# Altium project C40 UPGRADES.PrjPCB
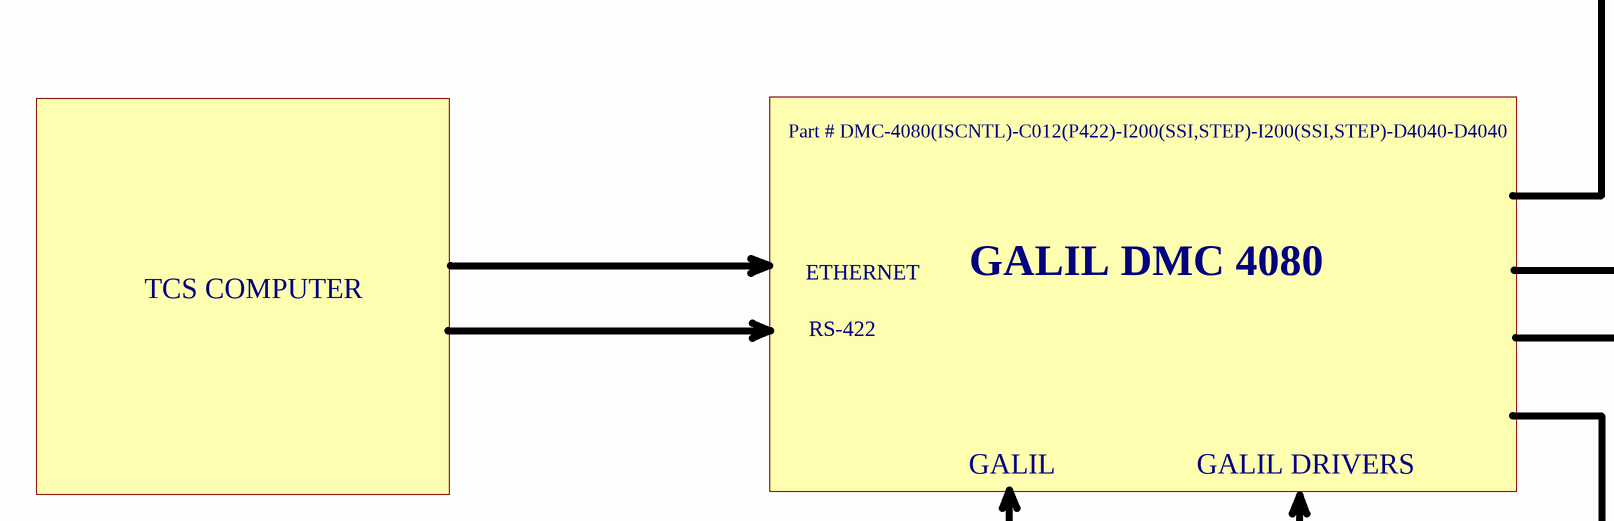
[diagram p0: C40_IMB_Upgrade_OVERVIEW.SCHDOC, top left]
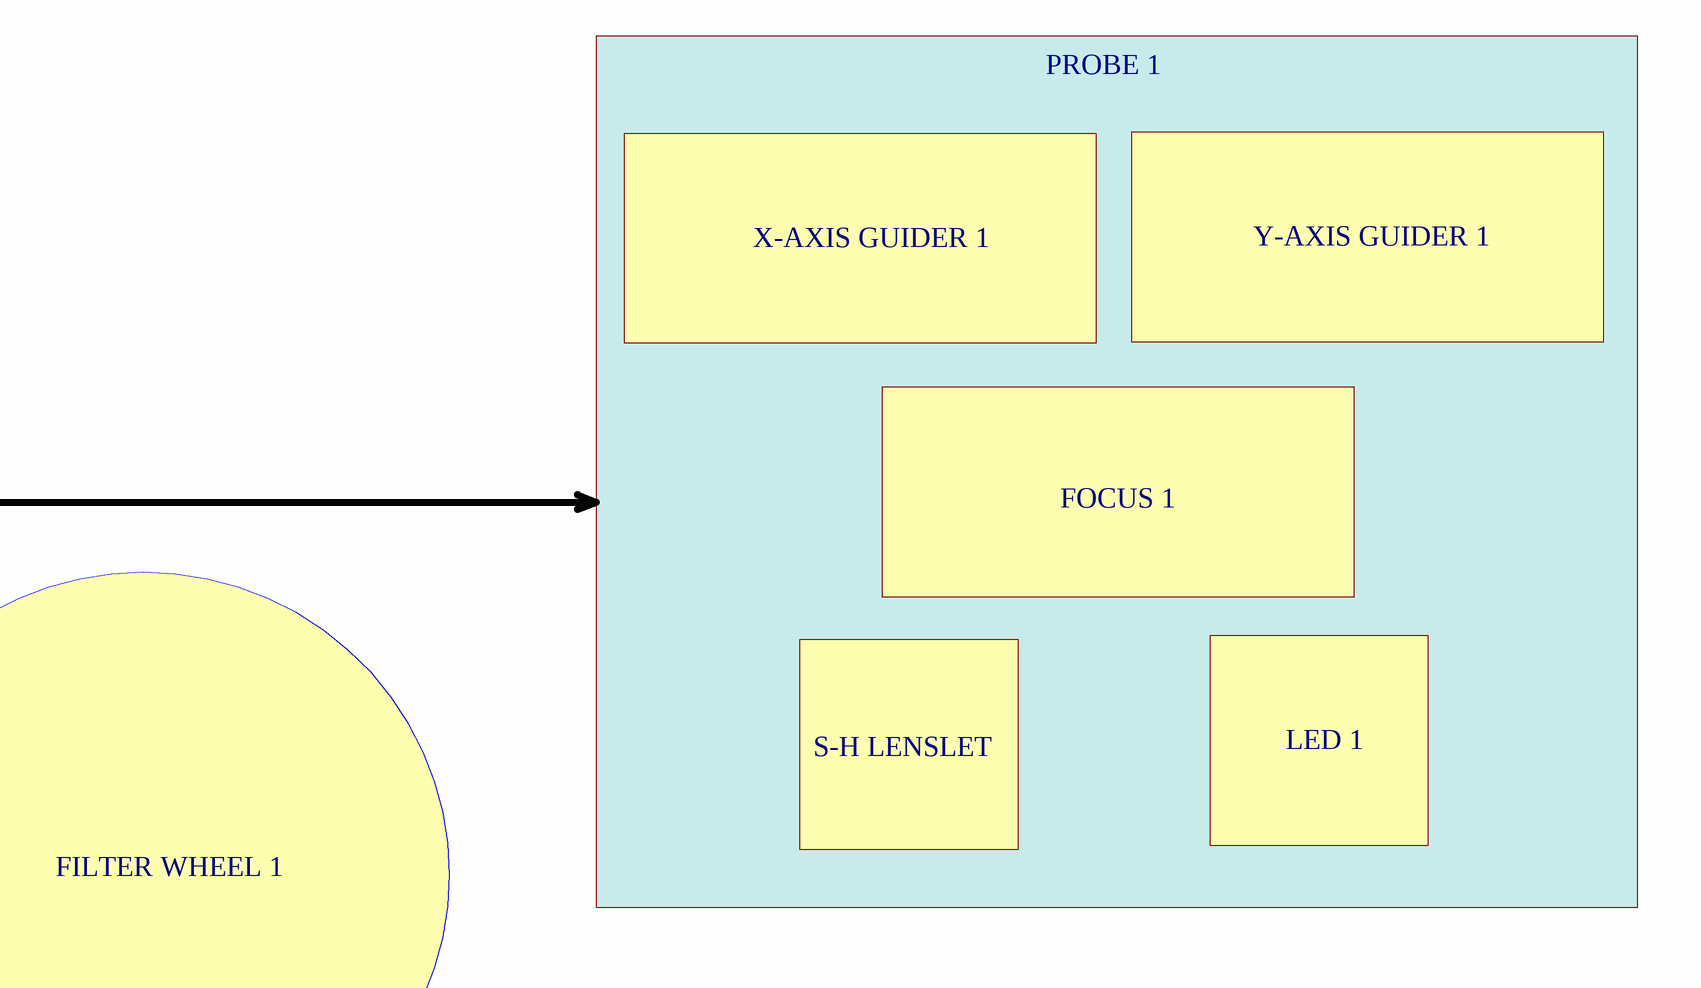
[diagram p1: C40_IMB_Upgrade_OVERVIEW.SCHDOC, top right]
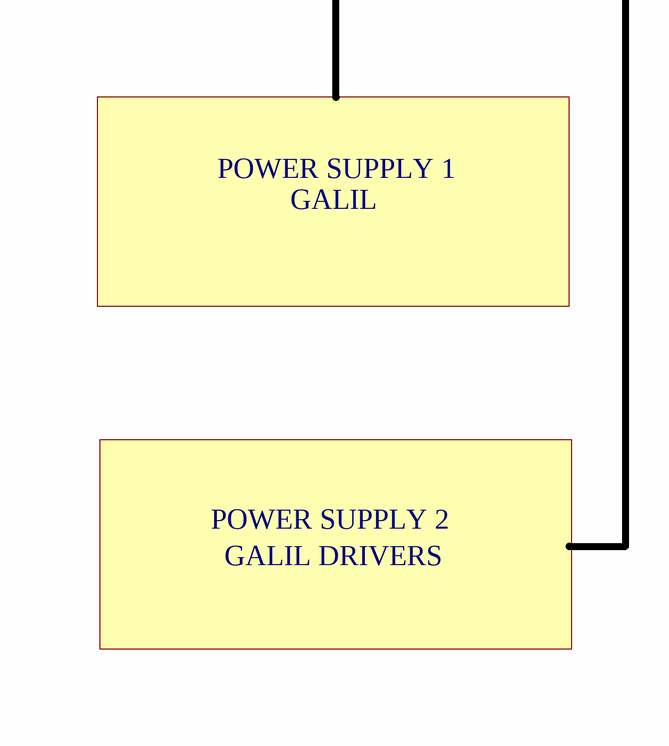
[diagram p2: C40_IMB_Upgrade_OVERVIEW.SCHDOC, bottom left]
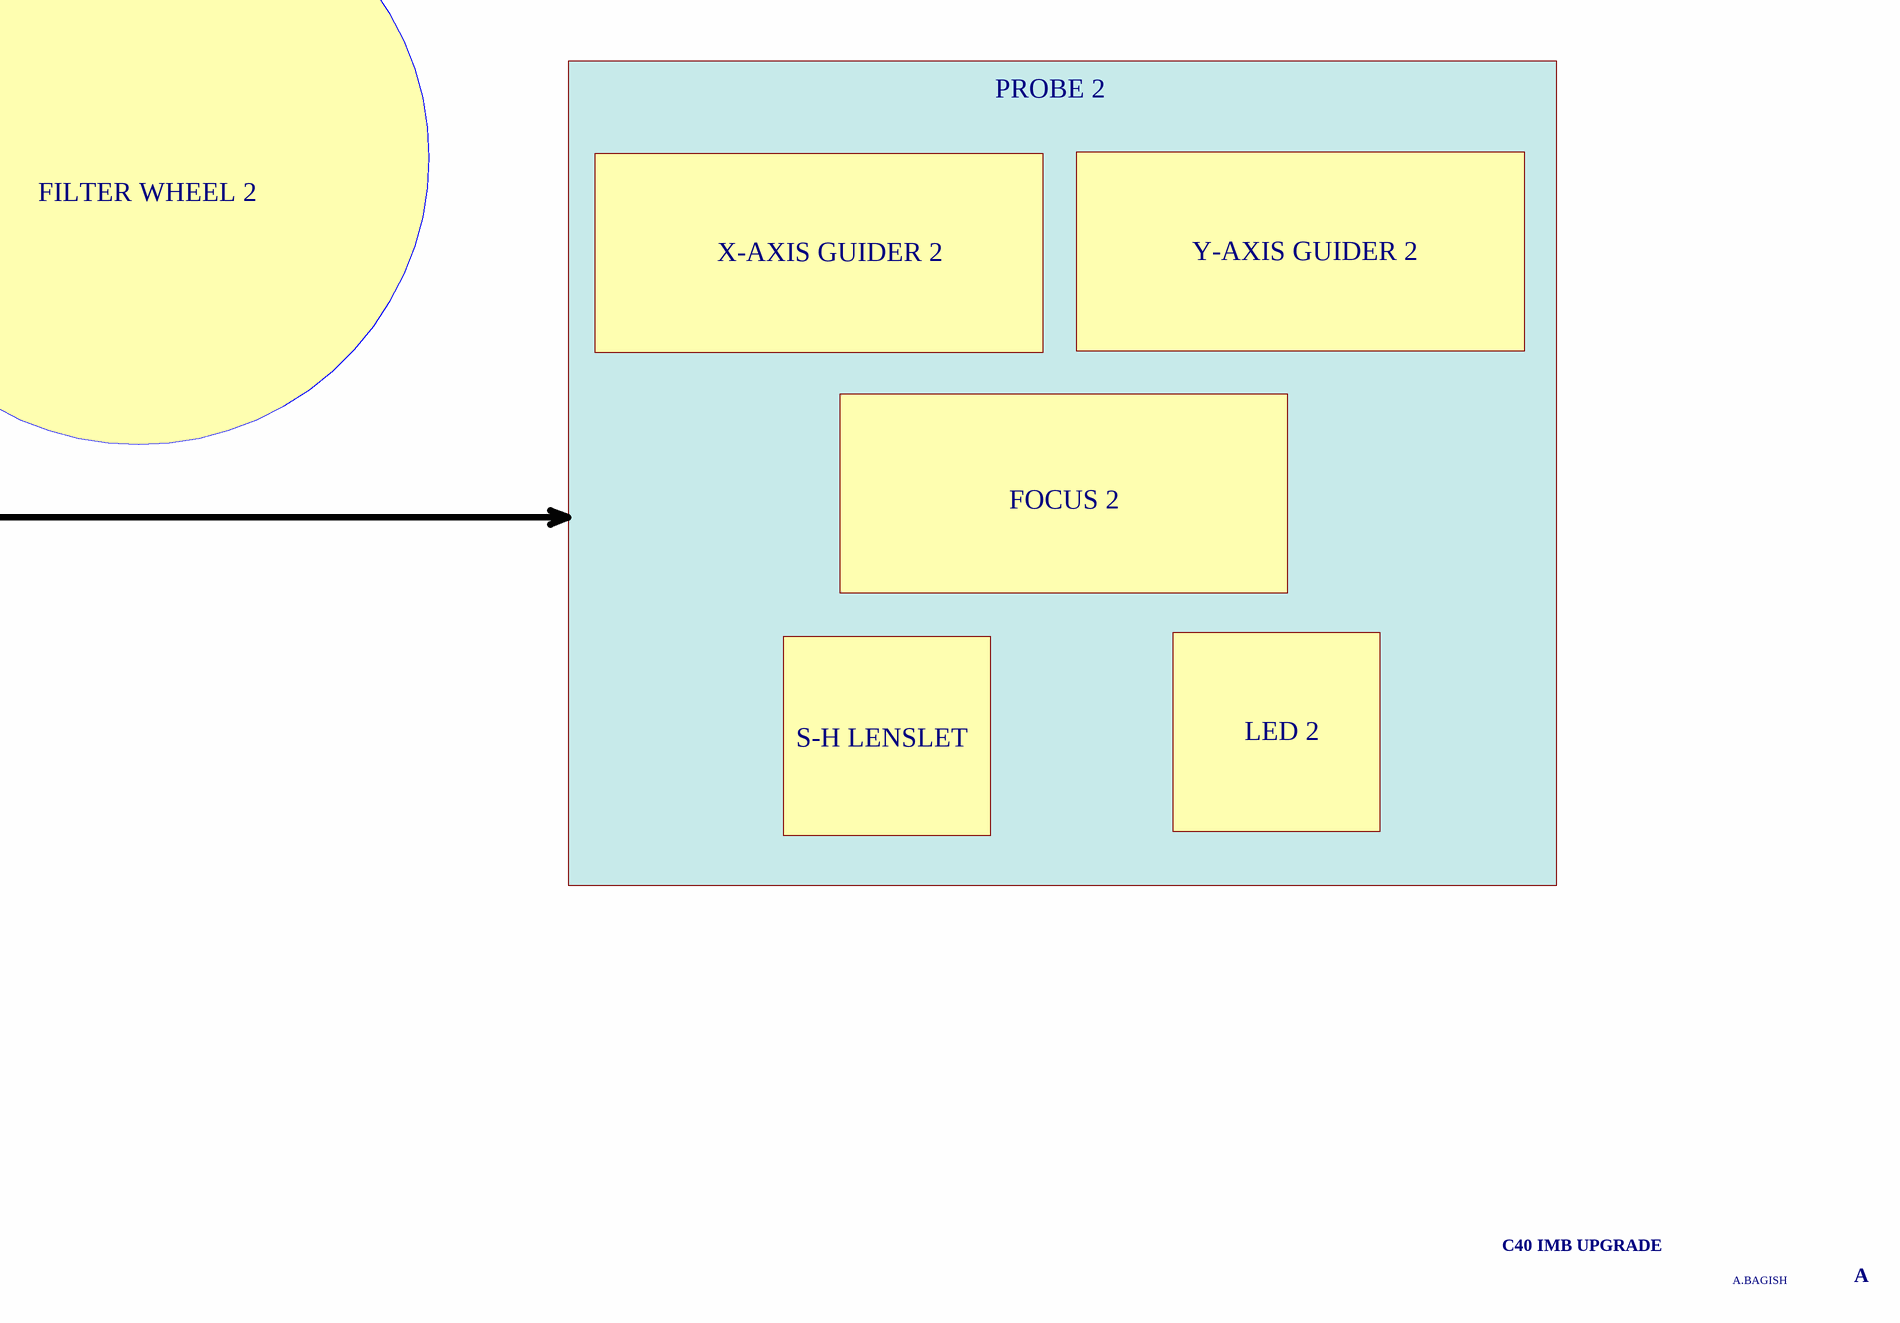
[diagram p3: C40_IMB_Upgrade_OVERVIEW.SCHDOC, bottom right]
6 sheets, 320 parts. Net scope: hierarchical (ports join the sheet entries above them; power ports are global).
Sheets:
  C40_IMB_Upgrade_OVERVIEW.SCHDOC
  C40_IMB_2nd level_block_diagram.SCHDOC
  HARNESS.SchDoc
    CYLINDERS/LIMITS = CYLINDERS.SchDoc
    ENCODERS/LIMITS = MOTORS ENCODERS.SchDoc
    X-Y MOTORS/BRAKES = MOTORS ENCODERS.SchDoc
  POWER SUPPLY.SchDoc

## Sheet C40_IMB_Upgrade_OVERVIEW.SCHDOC
size 812 x 571 mm; DocumentNumber: 2; SheetNumber: 2; SheetTotal: 7; PageSetup: Record=PageOptions|CenterHorizontal=True|CenterVertical=True|PrintScale=0.46|XCorrection=1.00|YCorrection=1.00|PrintKind=0|BorderSize=5000000|LeftOffset=0|BottomOffset=0|Orientation=2|PaperLength=1000|PaperWidth=1000|Scale=100|PaperSource=259|PrintQuality=600|MediaType=1|DitherType=10|PaperKind=Letter (8.5 x 11")|PrintScaleMode=0

### Notes on the sheet
- PROBE 1
- X-AXIS GUIDER 1
- Y-AXIS GUIDER 1
- FOCUS 1
- S-H LENSLET
- LED 1
- FILTER WHEEL 1
- Part # DMC-4080(ISCNTL)-C012(P422)-I200(SSI,STEP)-I200(SSI,STEP)-D4040-D4040
- TCS COMPUTER
- ETHERNET
- GALIL DMC 4080
- RS-422
- GALIL
- GALIL DRIVERS
- PROBE 2
- FILTER WHEEL 2
- X-AXIS GUIDER 2
- Y-AXIS GUIDER 2
- POWER SUPPLY 1
- FOCUS 2
- LED 2
- POWER SUPPLY 2
- C40 IMB UPGRADE
- A.BAGISH
- A
- Carnegie Institution of Washington
- Pasadena, California 91101
- 813 Santa Barbara Street
- The Observatories
- PHONE (626) 577-1122               FAX (626) 795-8136
- Title:
- OCIW
- Size:
- Date:
- File:
- D
- Scale:
- Drawn By:
- Checked By:
- A. Bagish
- alanb
- Revision:
- Sheet          of

## Sheet C40_IMB_2nd level_block_diagram.SCHDOC: C40 IMB BLOCK DIAGRAM 2
size 812 x 571 mm; DocumentNumber: 3; SheetNumber: 3; SheetTotal: 7; PageSetup: Record=PageOptions|CenterHorizontal=True|CenterVertical=True|PrintScale=0.48|XCorrection=1.00|YCorrection=1.00|PrintKind=0|BorderSize=5000000|LeftOffset=0|BottomOffset=0|Orientation=2|PaperLength=1000|PaperWidth=1000|Scale=100|PaperSource=15|PrintQuality=1200|MediaType=1|DitherType=10|PaperKind=11 x 17|PrintScaleMode=1
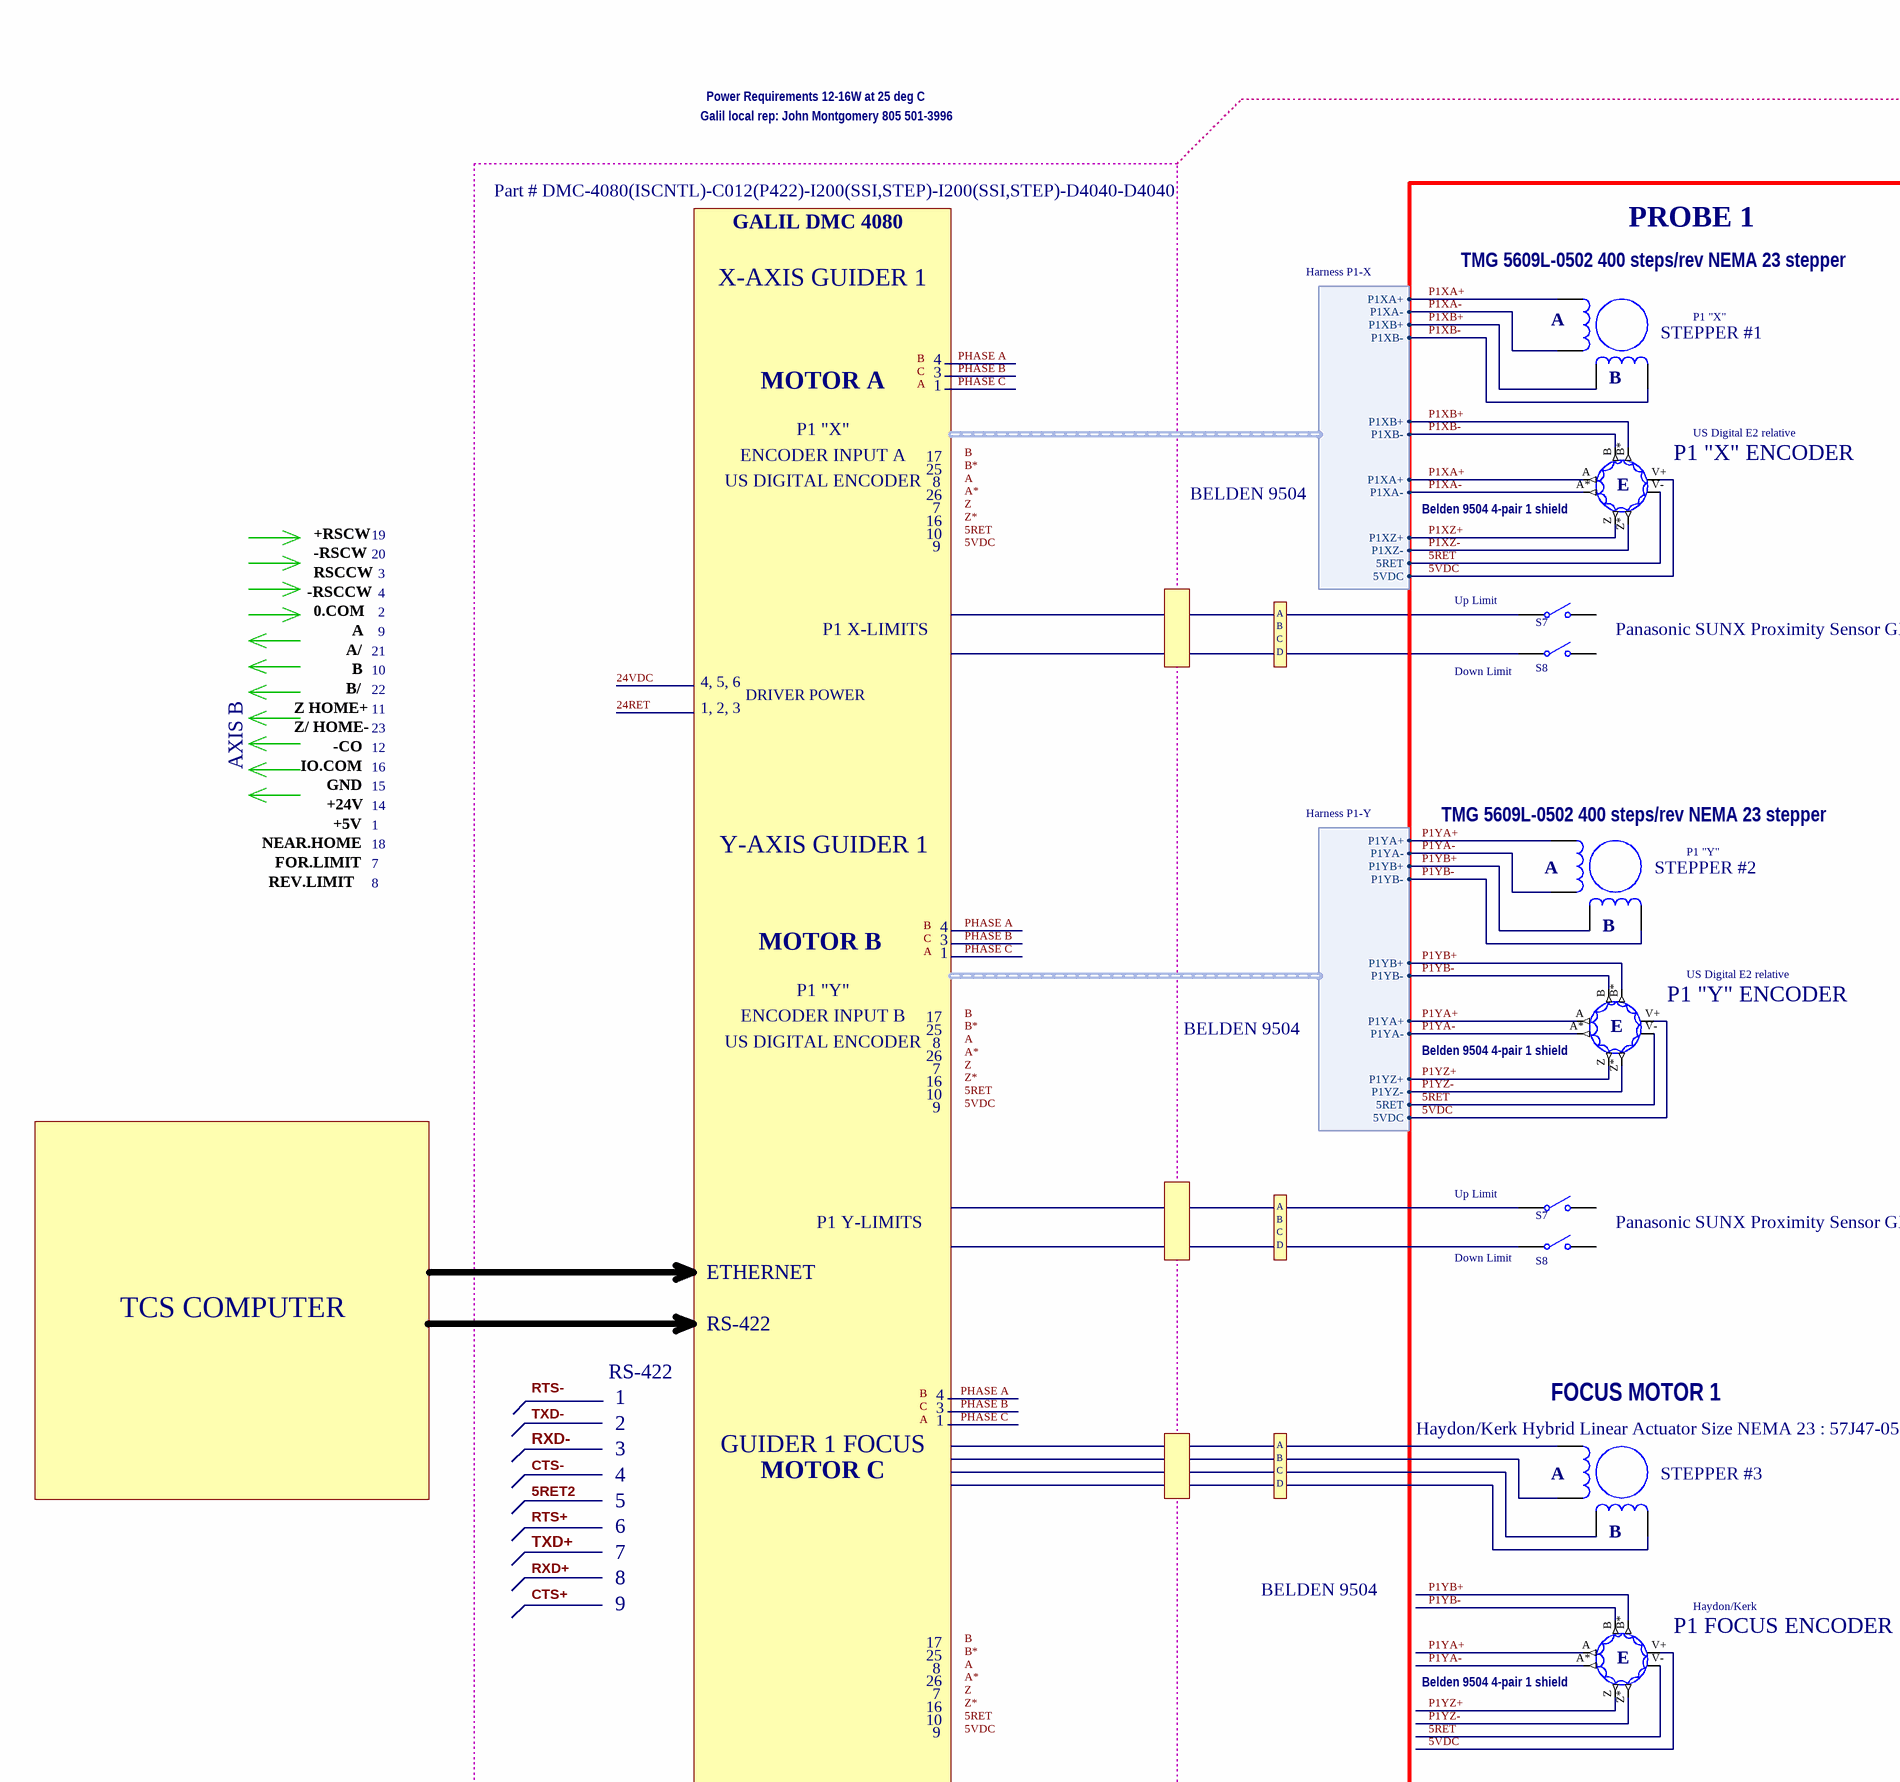
[diagram p4: C40_IMB_2nd level_block_diagram.SCHDOC, top left]
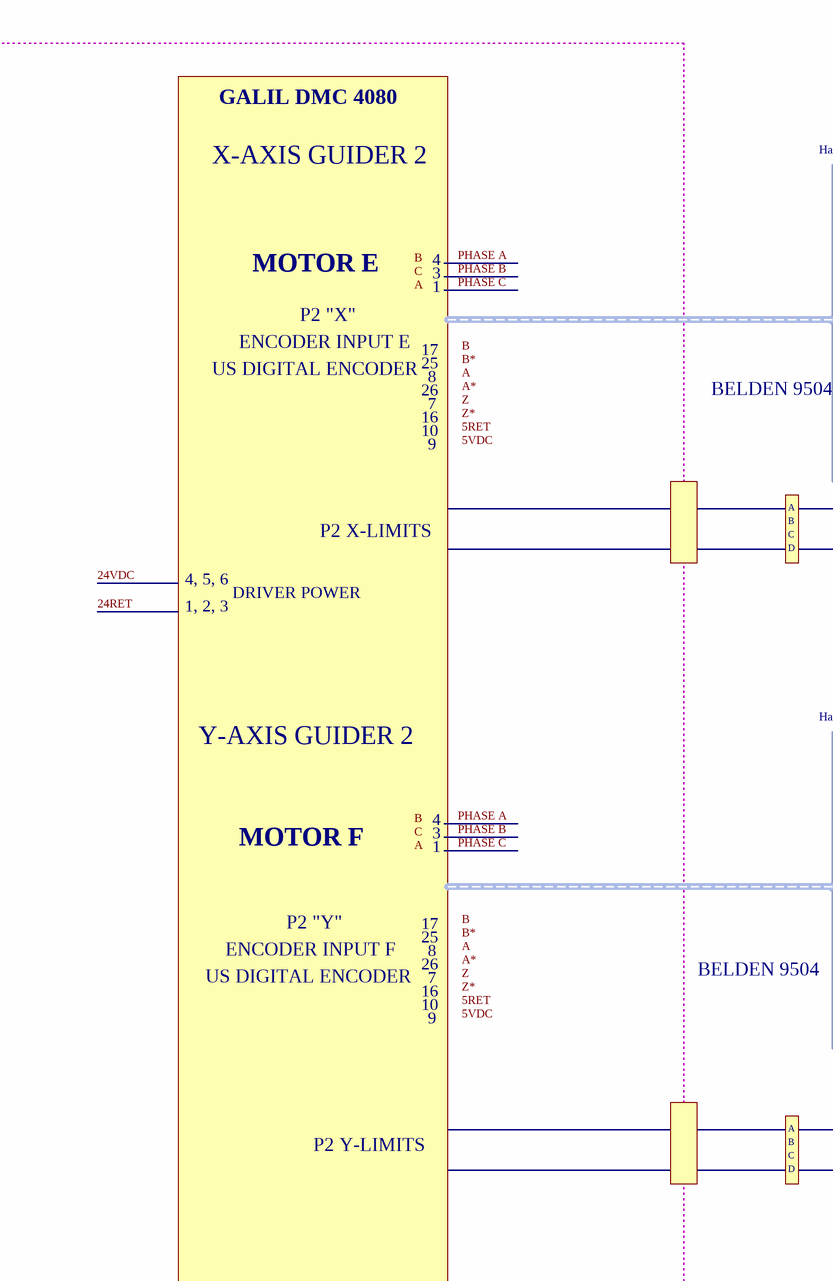
[diagram p5: C40_IMB_2nd level_block_diagram.SCHDOC, top middle]
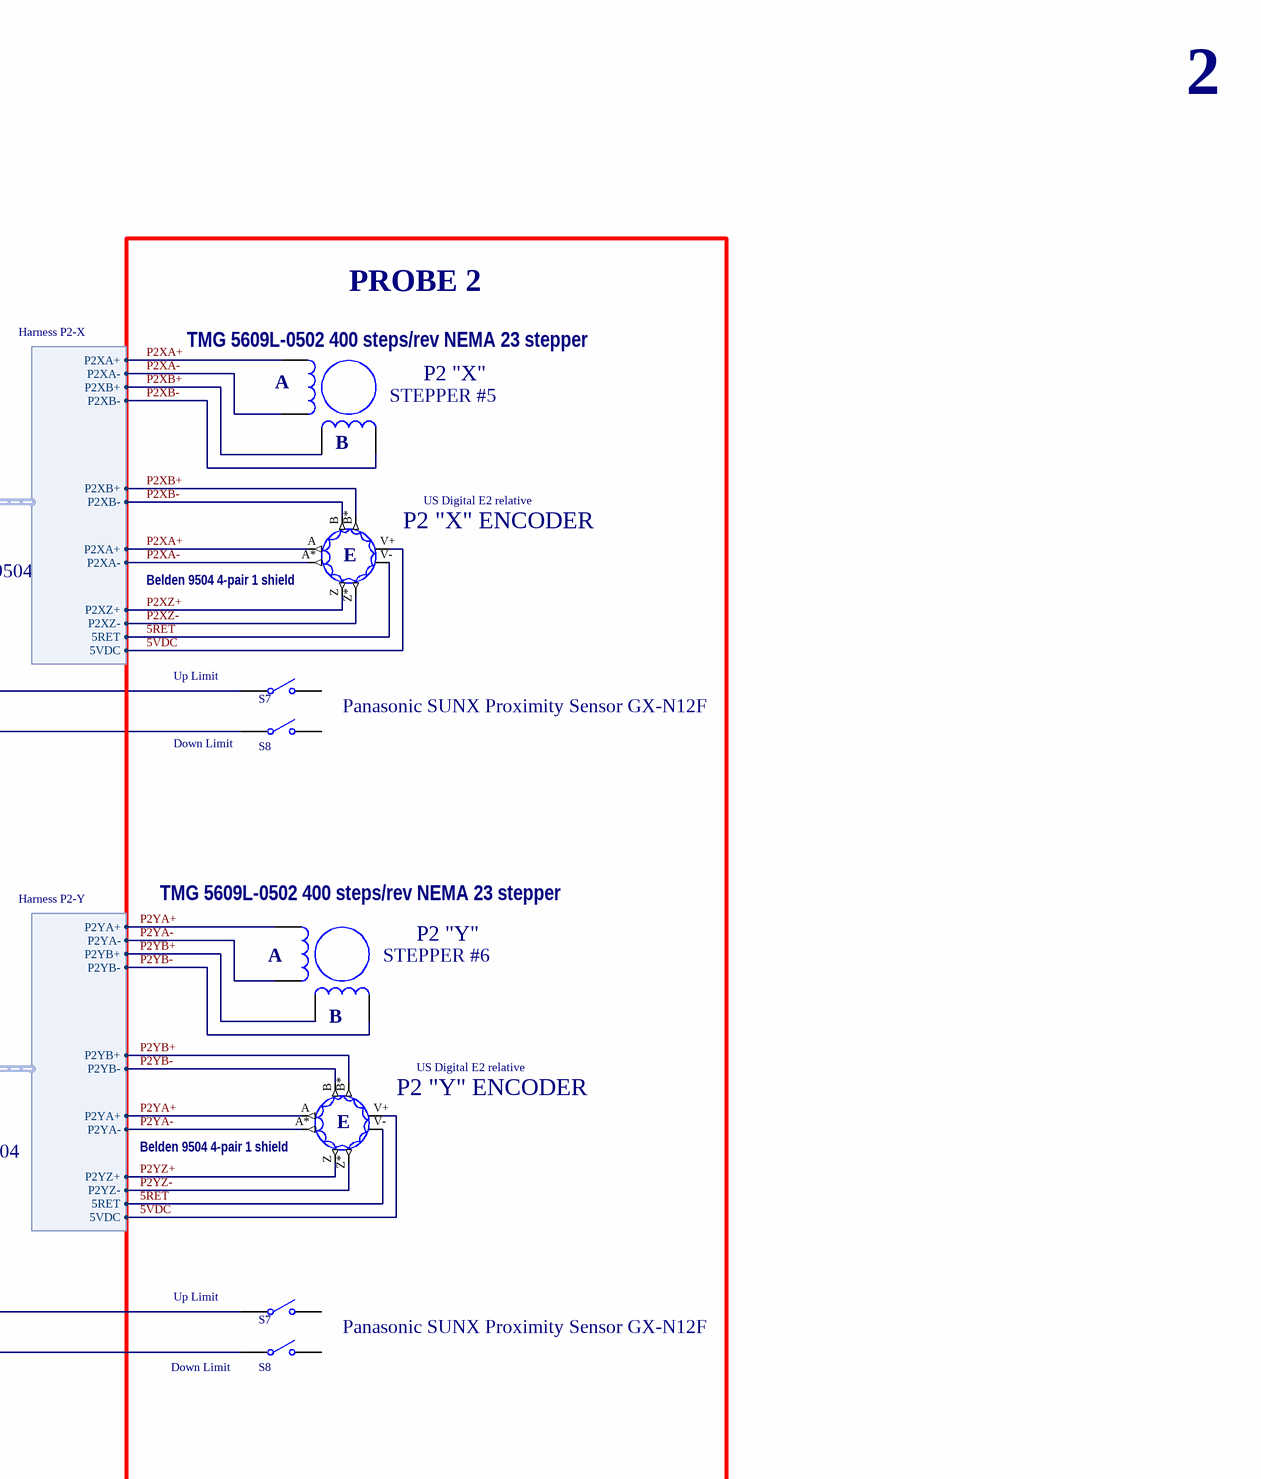
[diagram p6: C40_IMB_2nd level_block_diagram.SCHDOC, top right]
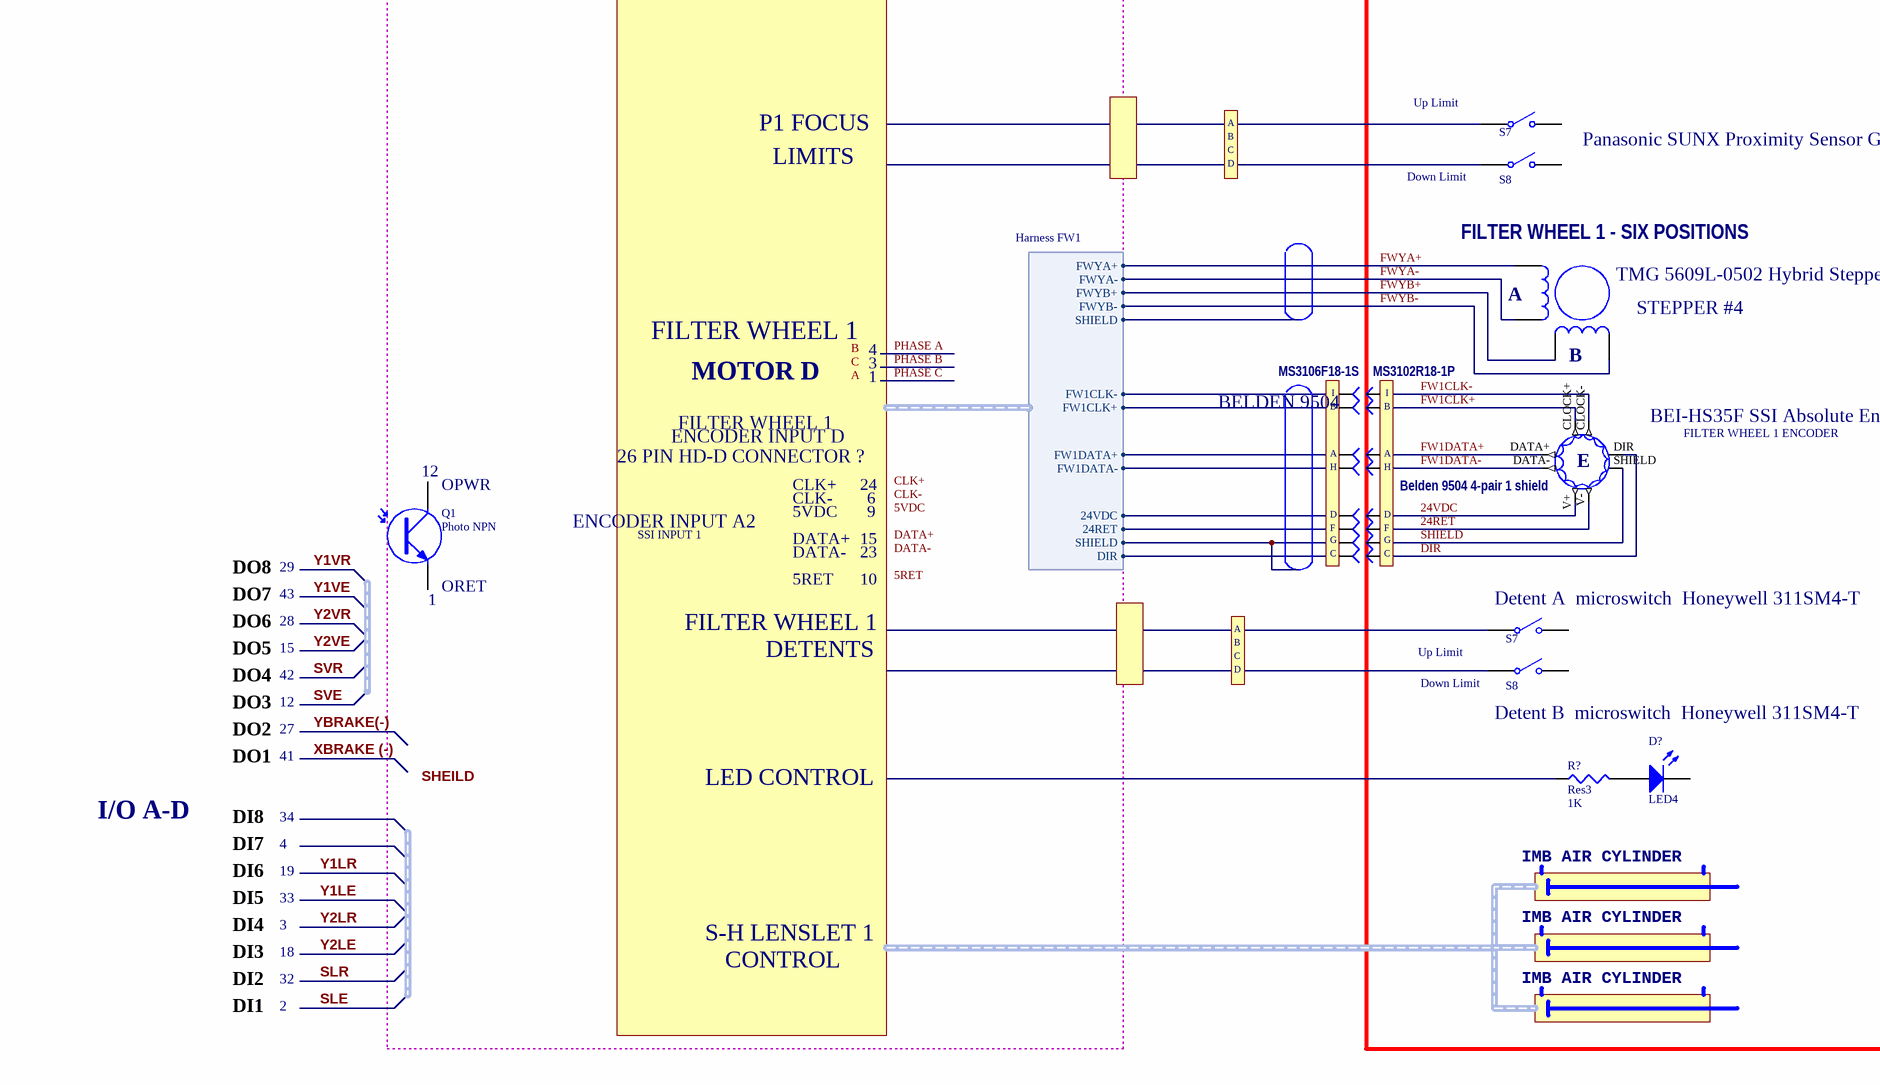
[diagram p7: C40_IMB_2nd level_block_diagram.SCHDOC, bottom left]
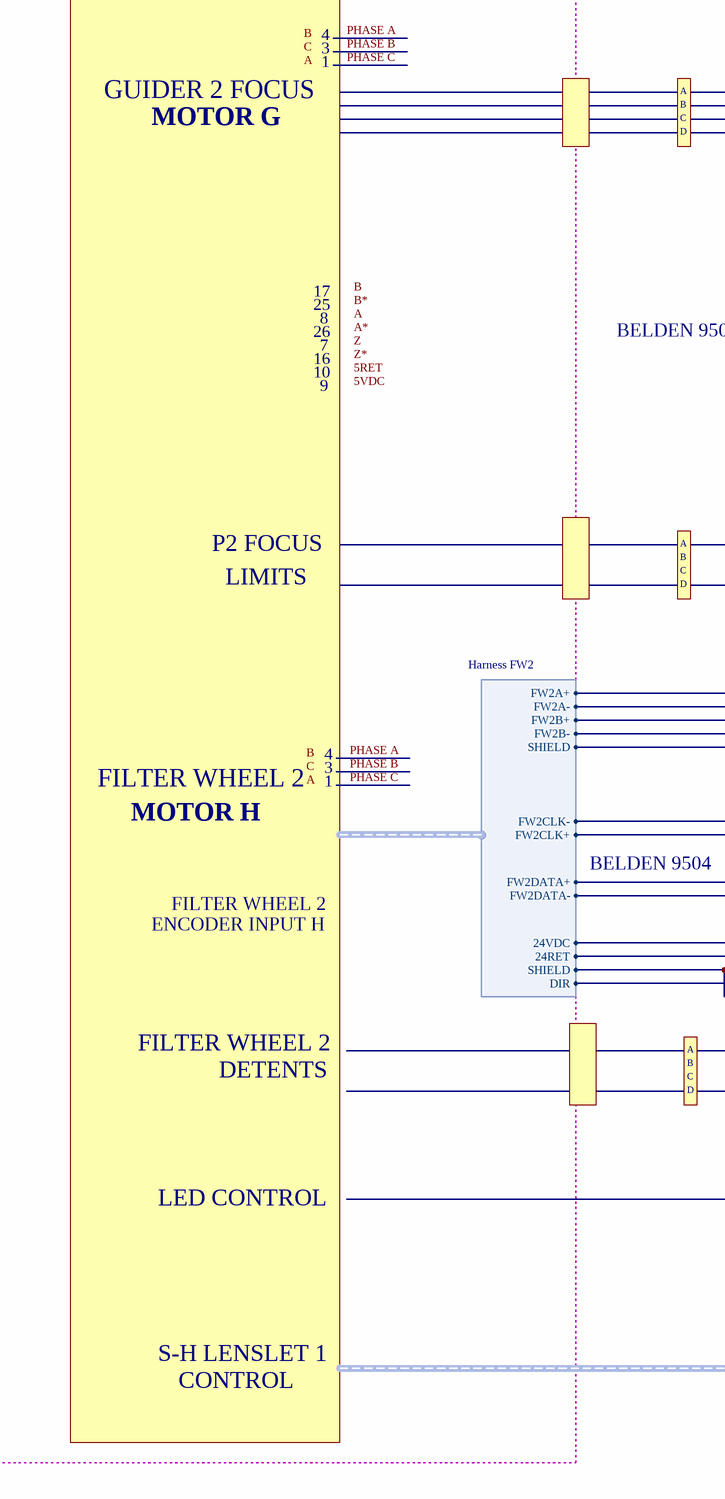
[diagram p8: C40_IMB_2nd level_block_diagram.SCHDOC, bottom middle]
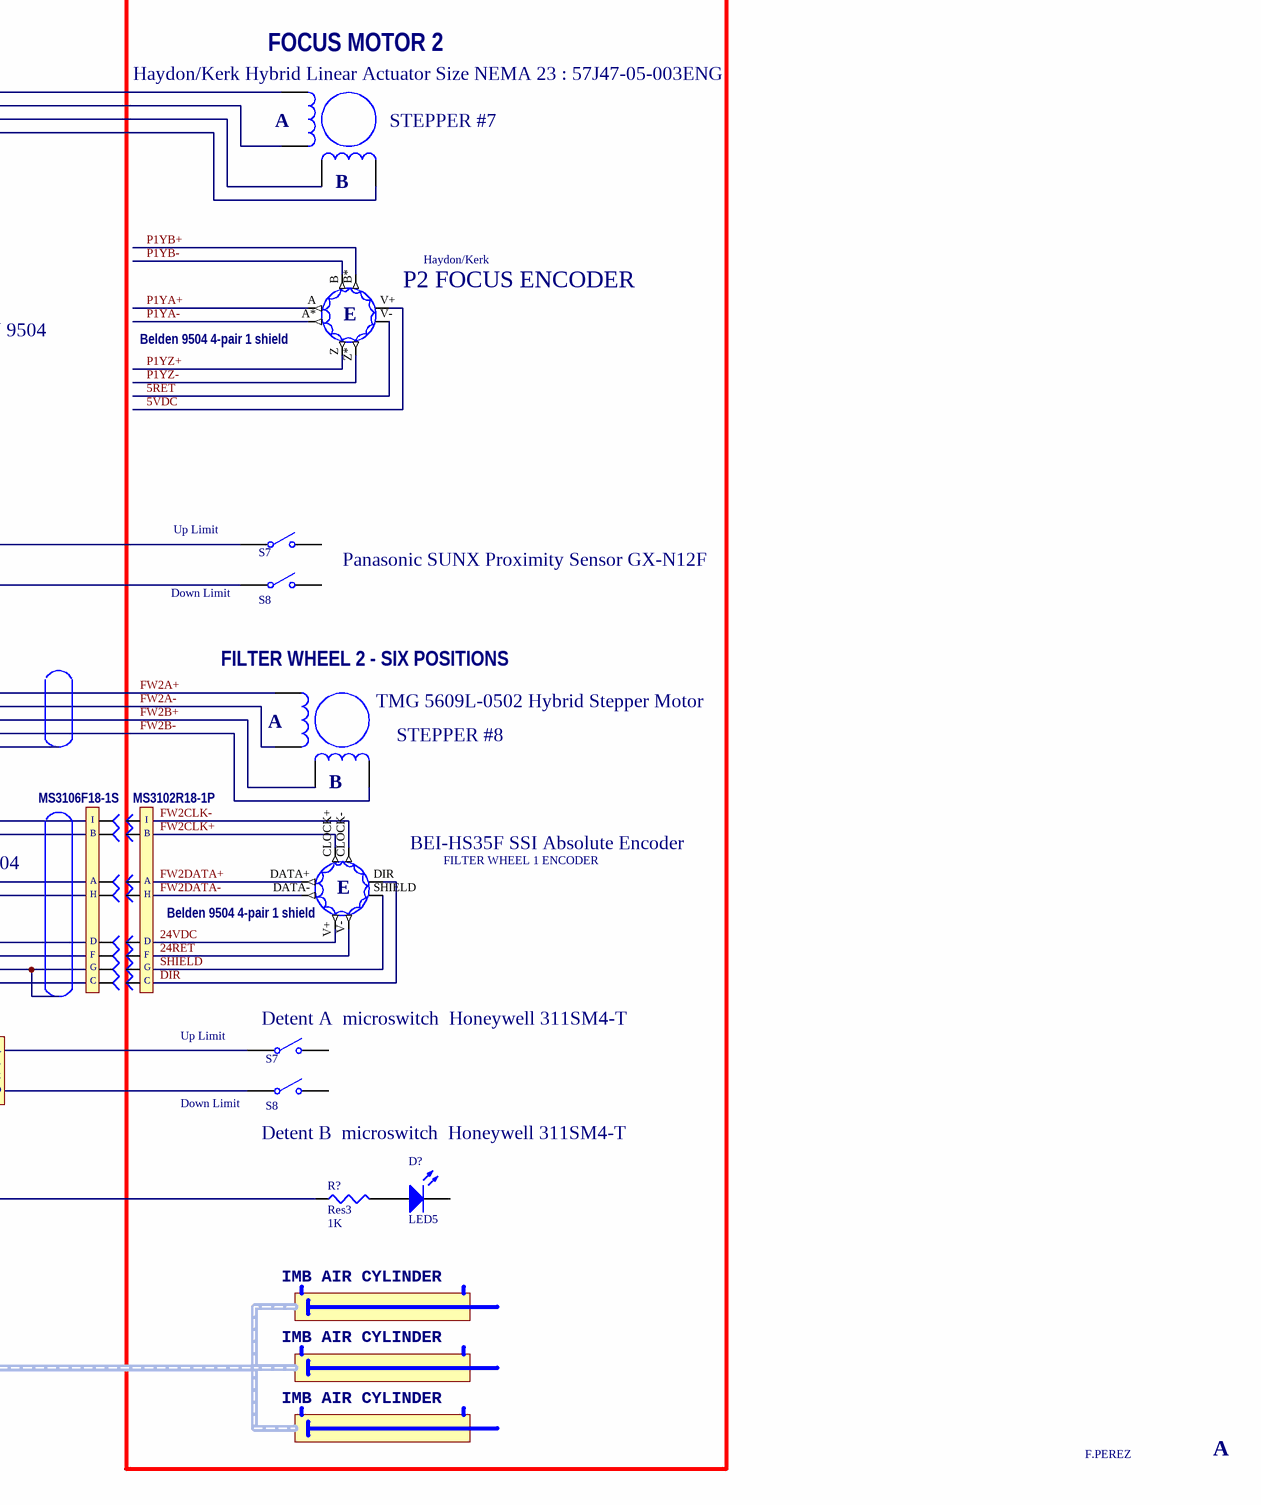
[diagram p9: C40_IMB_2nd level_block_diagram.SCHDOC, bottom right]

### Parts
(Parts that share a designator on the sheet are numbered #1, #2 ... from top to bottom, then left to right.)
?#1  (no value)
?#2  (no value)
?#3  (no value)
?#4  (no value)
?#5  (no value)
?#6  (no value)
?#7  (no value)
?#8  (no value)
?#9  (no value)
?#10  (no value)
?#11  (no value)
?#12  (no value)
?#13  (no value)
?#14  (no value)
?#15  (no value)
?#16  (no value)
B#1  (no value)
B#2  (no value)
B#3  (no value)
B#4  (no value)
B#5  (no value)
B#6  (no value)
B#7  (no value)
B#8  (no value)
B#9  (no value)
B#10  (no value)
B#11  (no value)
B#12  (no value)
B#13  (no value)
B#14  (no value)
B#15  (no value)
B#16  (no value)
BEI-HS35F_SSI_Absolute_Encoder#1  FILTER WHEEL 1 ENCODER
BEI-HS35F_SSI_Absolute_Encoder#2  FILTER WHEEL 1 ENCODER
D?#1  LED4  [LED-1]
D?#2  LED5  [LED-1]
Haydon/Kerk#1  P1 FOCUS ENCODER
Haydon/Kerk#2  P2 FOCUS ENCODER
Haydon/Kerk_Hybrid_Linear_Actuator_Size_NEMA_23_:_57J47-05-003ENG#1  STEPPER #3
Haydon/Kerk_Hybrid_Linear_Actuator_Size_NEMA_23_:_57J47-05-003ENG#2  STEPPER #7
IMB_AIR_CYLINDER#1  (no value)
IMB_AIR_CYLINDER#2  (no value)
IMB_AIR_CYLINDER#3  (no value)
IMB_AIR_CYLINDER#4  (no value)
IMB_AIR_CYLINDER#5  (no value)
IMB_AIR_CYLINDER#6  (no value)
P1_"X"  STEPPER #1
P1_"Y"  STEPPER #2
P2_"X"  STEPPER #5
P2_"Y"  STEPPER #6
Q1  Photo NPN  [SFM-T2(3)/X1.6V]
R?#1  Res3  value 1K  [J1-0603]
R?#2  Res3  value 1K  [J1-0603]
S7#1  Up Limit  [SPST-2]
S7#2  Up Limit  [SPST-2]
S7#3  Up Limit  [SPST-2]
S7#4  Up Limit  [SPST-2]
S7#5  Up Limit  [SPST-2]
S7#6  Up Limit  [SPST-2]
S7#7  Up Limit  [SPST-2]
S7#8  Up Limit  [SPST-2]
S8#1  Down Limit  [SPST-2]
S8#2  Down Limit  [SPST-2]
S8#3  Down Limit  [SPST-2]
S8#4  Down Limit  [SPST-2]
S8#5  Down Limit  [SPST-2]
S8#6  Down Limit  [SPST-2]
S8#7  Down Limit  [SPST-2]
S8#8  Down Limit  [SPST-2]
TMG_5609L-0502_Hybrid_Stepper_Motor#1  STEPPER #4
TMG_5609L-0502_Hybrid_Stepper_Motor#2  STEPPER #8
US_Digital_E2_relative#1  P1 "X" ENCODER
US_Digital_E2_relative#2  P2 "X" ENCODER
US_Digital_E2_relative#3  P1 "Y" ENCODER
US_Digital_E2_relative#4  P2 "Y" ENCODER

### Blocks framed on the sheet
PROBE 1: B#1 B#3 B#5 B#7 B#9 B#11 B#13 B#15 BEI-HS35F_SSI_Absolute_Encoder#1 D?#1 Haydon/Kerk#1 Haydon/Kerk_Hybrid_Linear_Actuator_Size_NEMA_23_:_57J47-05-003ENG#1 IMB_AIR_CYLINDER#1 IMB_AIR_CYLINDER#3 IMB_AIR_CYLINDER#5 P1_"X" P1_"Y" R?#1 S7#1 S7#3 S7#5 S7#7 S8#1 S8#3 S8#5 S8#7 TMG_5609L-0502_Hybrid_Stepper_Motor#1 US_Digital_E2_relative#1 US_Digital_E2_relative#3
PROBE 2: B#2 B#4 B#6 B#8 B#10 B#12 B#14 B#16 BEI-HS35F_SSI_Absolute_Encoder#2 D?#2 Haydon/Kerk#2 Haydon/Kerk_Hybrid_Linear_Actuator_Size_NEMA_23_:_57J47-05-003ENG#2 IMB_AIR_CYLINDER#2 IMB_AIR_CYLINDER#4 IMB_AIR_CYLINDER#6 P2_"X" P2_"Y" R?#2 S7#2 S7#4 S7#6 S7#8 S8#2 S8#4 S8#6 S8#8 TMG_5609L-0502_Hybrid_Stepper_Motor#2 US_Digital_E2_relative#2 US_Digital_E2_relative#4

### Harnesses
Harness P1-X: P1XA+, P1XA-, P1XB+, P1XB-, P1XB+, P1XB-, P1XA+, P1XA-, P1XZ+, P1XZ-, 5RET, 5VDC
Harness P1-Y: P1YA+, P1YA-, P1YB+, P1YB-, P1YB+, P1YB-, P1YA+, P1YA-, P1YZ+, P1YZ-, 5RET, 5VDC
Harness P2-X: P2XA+, P2XA-, P2XB+, P2XB-, P2XB+, P2XB-, P2XA+, P2XA-, P2XZ+, P2XZ-, 5RET, 5VDC
Harness P2-Y: P2YA+, P2YA-, P2YB+, P2YB-, P2YB+, P2YB-, P2YA+, P2YA-, P2YZ+, P2YZ-, 5RET, 5VDC
Harness FW1: FWYA+, FWYA-, FWYB+, FWYB-, FW1CLK-, FW1CLK+, FW1DATA+, FW1DATA-, 24VDC, 24RET, SHIELD, DIR, SHIELD
Harness FW2: FW2A+, FW2A-, FW2B+, FW2B-, FW2CLK-, FW2CLK+, FW2DATA+, FW2DATA-, 24VDC, 24RET, SHIELD, DIR, SHIELD

### Nets
5RET: Haydon/Kerk#1.V- Haydon/Kerk#2.V- US_Digital_E2_relative#1.V- US_Digital_E2_relative#2.V- US_Digital_E2_relative#3.V- US_Digital_E2_relative#4.V- ; harness Harness P1-X.5RET, harness Harness P1-Y.5RET, harness Harness P2-X.5RET, harness Harness P2-Y.5RET
5VDC: Haydon/Kerk#1.V+ Haydon/Kerk#2.V+ US_Digital_E2_relative#1.V+ US_Digital_E2_relative#2.V+ US_Digital_E2_relative#3.V+ US_Digital_E2_relative#4.V+ ; harness Harness P1-X.5VDC, harness Harness P1-Y.5VDC, harness Harness P2-X.5VDC, harness Harness P2-Y.5VDC
24RET: B#11.?1 B#12.?1 BEI-HS35F_SSI_Absolute_Encoder#1.V- BEI-HS35F_SSI_Absolute_Encoder#2.V-
24VDC: B#9.?1 B#10.?1 BEI-HS35F_SSI_Absolute_Encoder#1.V+ BEI-HS35F_SSI_Absolute_Encoder#2.V+
DIR: B#15.?1 B#16.?1 BEI-HS35F_SSI_Absolute_Encoder#1.DIR BEI-HS35F_SSI_Absolute_Encoder#2.DIR
FW1CLK+: B#3.?1 BEI-HS35F_SSI_Absolute_Encoder#1.CLOCK+
FW1CLK-: BEI-HS35F_SSI_Absolute_Encoder#1.CLOCK-
FW1DATA+: B#5.?1 BEI-HS35F_SSI_Absolute_Encoder#1.DATA+
FW1DATA-: B#7.?1 BEI-HS35F_SSI_Absolute_Encoder#1.DATA-
FW2A+: TMG_5609L-0502_Hybrid_Stepper_Motor#2.1 ; harness Harness FW2.FW2A+
FW2A-: TMG_5609L-0502_Hybrid_Stepper_Motor#2.3 ; harness Harness FW2.FW2A-
FW2B+: TMG_5609L-0502_Hybrid_Stepper_Motor#2.4 ; harness Harness FW2.FW2B+
FW2B-: TMG_5609L-0502_Hybrid_Stepper_Motor#2.6 ; harness Harness FW2.FW2B-
FW2CLK+: B#4.?1 BEI-HS35F_SSI_Absolute_Encoder#2.CLOCK+
FW2CLK-: BEI-HS35F_SSI_Absolute_Encoder#2.CLOCK-
FW2DATA+: B#6.?1 BEI-HS35F_SSI_Absolute_Encoder#2.DATA+
FW2DATA-: B#8.?1 BEI-HS35F_SSI_Absolute_Encoder#2.DATA-
FWYA+: TMG_5609L-0502_Hybrid_Stepper_Motor#1.1 ; harness Harness FW1.FWYA+
FWYA-: TMG_5609L-0502_Hybrid_Stepper_Motor#1.3 ; harness Harness FW1.FWYA-
FWYB+: TMG_5609L-0502_Hybrid_Stepper_Motor#1.4 ; harness Harness FW1.FWYB+
FWYB-: TMG_5609L-0502_Hybrid_Stepper_Motor#1.6 ; harness Harness FW1.FWYB-
P1XA+: P1_"X".1 US_Digital_E2_relative#1.A ; harness Harness P1-X.P1XA+
P1XA-: P1_"X".3 US_Digital_E2_relative#1.A* ; harness Harness P1-X.P1XA-
P1XB+: P1_"X".4 US_Digital_E2_relative#1.B* ; harness Harness P1-X.P1XB+
P1XB-: P1_"X".6 US_Digital_E2_relative#1.B ; harness Harness P1-X.P1XB-
P1XZ+: US_Digital_E2_relative#1.Z ; harness Harness P1-X.P1XZ+
P1XZ-: US_Digital_E2_relative#1.Z* ; harness Harness P1-X.P1XZ-
P1YA+: Haydon/Kerk#1.A Haydon/Kerk#2.A P1_"Y".1 US_Digital_E2_relative#3.A ; harness Harness P1-Y.P1YA+
P1YA-: Haydon/Kerk#1.A* Haydon/Kerk#2.A* P1_"Y".3 US_Digital_E2_relative#3.A* ; harness Harness P1-Y.P1YA-
P1YB+: Haydon/Kerk#1.B* Haydon/Kerk#2.B* P1_"Y".4 US_Digital_E2_relative#3.B* ; harness Harness P1-Y.P1YB+
P1YB-: Haydon/Kerk#1.B Haydon/Kerk#2.B P1_"Y".6 US_Digital_E2_relative#3.B ; harness Harness P1-Y.P1YB-
P1YZ+: Haydon/Kerk#1.Z Haydon/Kerk#2.Z US_Digital_E2_relative#3.Z ; harness Harness P1-Y.P1YZ+
P1YZ-: Haydon/Kerk#1.Z* Haydon/Kerk#2.Z* US_Digital_E2_relative#3.Z* ; harness Harness P1-Y.P1YZ-
P2XA+: P2_"X".1 US_Digital_E2_relative#2.A ; harness Harness P2-X.P2XA+
P2XA-: P2_"X".3 US_Digital_E2_relative#2.A* ; harness Harness P2-X.P2XA-
P2XB+: P2_"X".4 US_Digital_E2_relative#2.B* ; harness Harness P2-X.P2XB+
P2XB-: P2_"X".6 US_Digital_E2_relative#2.B ; harness Harness P2-X.P2XB-
P2XZ+: US_Digital_E2_relative#2.Z ; harness Harness P2-X.P2XZ+
P2XZ-: US_Digital_E2_relative#2.Z* ; harness Harness P2-X.P2XZ-
P2YA+: P2_"Y".1 US_Digital_E2_relative#4.A ; harness Harness P2-Y.P2YA+
P2YA-: P2_"Y".3 US_Digital_E2_relative#4.A* ; harness Harness P2-Y.P2YA-
P2YB+: P2_"Y".4 US_Digital_E2_relative#4.B* ; harness Harness P2-Y.P2YB+
P2YB-: P2_"Y".6 US_Digital_E2_relative#4.B ; harness Harness P2-Y.P2YB-
P2YZ+: US_Digital_E2_relative#4.Z ; harness Harness P2-Y.P2YZ+
P2YZ-: US_Digital_E2_relative#4.Z* ; harness Harness P2-Y.P2YZ-
SHIELD: B#13.?1 B#14.?1 BEI-HS35F_SSI_Absolute_Encoder#1.SHIELD BEI-HS35F_SSI_Absolute_Encoder#2.SHIELD
NetD?#1_1: D?#1.1(A) R?#1.2
NetD?#2_1: D?#2.1(A) R?#2.2

Not connected (* = marked no-connect by the designer): ?#1 ?1; ?#2 ?1; ?#3 ?1; ?#4 ?1; ?#5 ?1; ?#6 ?1; ?#7 ?1; ?#8 ?1; ?#9 ?1; ?#10 ?1; ?#11 ?1; ?#12 ?1; ?#13 ?1; ?#14 ?1; ?#15 ?1; ?#16 ?1; B#1 ?1; B#2 ?1; D?#1 2(K); D?#2 2(K); Haydon/Kerk_Hybrid_Linear_Actuator_Size_NEMA_23_:_57J47-05-003ENG#1 1 3 4 6; Haydon/Kerk_Hybrid_Linear_Actuator_Size_NEMA_23_:_57J47-05-003ENG#2 1 3 4 6; Q1 1(C) 3(E); R?#1 1; R?#2 1; S7#1 1(COMMON) 2(NO); S7#2 1(COMMON) 2(NO); S7#3 1(COMMON) 2(NO); S7#4 1(COMMON) 2(NO); S7#5 1(COMMON) 2(NO); S7#6 1(COMMON) 2(NO); S7#7 1(COMMON) 2(NO); S7#8 1(COMMON) 2(NO); S8#1 1(COMMON) 2(NO); S8#2 1(COMMON) 2(NO); S8#3 1(COMMON) 2(NO); S8#4 1(COMMON) 2(NO); S8#5 1(COMMON) 2(NO); S8#6 1(COMMON) 2(NO); S8#7 1(COMMON) 2(NO); S8#8 1(COMMON) 2(NO)

### Notes on the sheet
- 2
- Galil local rep: John Montgomery 805 501-3996
- Power Requirements 12-16W at 25 deg C
- Full hardware handshaking required for Galil controller
- Part # DMC-4080(ISCNTL)-C012(P422)-I200(SSI,STEP)-I200(SSI,STEP)-D4040-D4040
- GALIL DMC 4080
- (near P1_"X") TMG 5609L-0502 400 steps/rev NEMA 23 stepper
- X-AXIS GUIDER 1
- (near P1_"X") A
- X-AXIS GUIDER 2
- (near P2_"X") TMG 5609L-0502 400 steps/rev NEMA 23 stepper
- (near P2_"X") A
- MOTOR A
- 4
- 1
- 3
- (near P1_"X") B
- MOTOR E
- (near P2_"X") B
- ENCODER INPUT A
- P1 "X"
- 17
- ENCODER INPUT E
- P2 "X"
- US DIGITAL ENCODER
- 25
- 26
- 16
- 8
- 7
- BELDEN 9504
- (near US_Digital_E2_relative#1) Belden 9504 4-pair 1 shield
- (near US_Digital_E2_relative#2) Belden 9504 4-pair 1 shield
- RSCCW
- -RSCW
- +RSCW
- 20
- 19
- 10
- 9
- -RSCCW
- 0.COM
- A/
- A
- 21
- P1 X-LIMITS
- D
- C
- B
- Panasonic SUNX Proximity Sensor GX-N12F
- P2 X-LIMITS
- Z HOME+
- B/
- 22
- 11
- 1, 2, 3
- 4, 5, 6
- DRIVER POWER
- AXIS B
- Z/ HOME-
- IO.COM
- GND
- -CO
- 23
- 12
- 15
- NEAR.HOME
- +24V
- +5V
- 14
- 18
- (near P1_"Y") TMG 5609L-0502 400 steps/rev NEMA 23 stepper
- Y-AXIS GUIDER 2
- (near P2_"Y") TMG 5609L-0502 400 steps/rev NEMA 23 stepper
- REV.LIMIT
- FOR.LIMIT
- Y-AXIS GUIDER 1
- (near P1_"Y") A
- (near P2_"Y") A
- MOTOR B
- (near P1_"Y") B
- MOTOR F
- (near P2_"Y") B
- ENCODER INPUT B
- P1 "Y"
- ENCODER INPUT F
- P2 "Y"
- (near US_Digital_E2_relative#3) Belden 9504 4-pair 1 shield
- (near US_Digital_E2_relative#4) Belden 9504 4-pair 1 shield
- P1 Y-LIMITS
- P2 Y-LIMITS
- ETHERNET
- TCS COMPUTER
- RS-422
- (near Haydon/Kerk_Hybrid_Linear_Actuator_Size_NEMA_23_:_57J47-05-003ENG#1) FOCUS MOTOR 1
- (near Haydon/Kerk_Hybrid_Linear_Actuator_Size_NEMA_23_:_57J47-05-003ENG#2) FOCUS MOTOR 2
- GUIDER 1 FOCUS
- MOTOR C
- (near Haydon/Kerk_Hybrid_Linear_Actuator_Size_NEMA_23_:_57J47-05-003ENG#1) A
- GUIDER 2 FOCUS
- MOTOR G
- (near Haydon/Kerk_Hybrid_Linear_Actuator_Size_NEMA_23_:_57J47-05-003ENG#2) A
- 5
- 6
- (near Haydon/Kerk_Hybrid_Linear_Actuator_Size_NEMA_23_:_57J47-05-003ENG#1) B
- (near Haydon/Kerk_Hybrid_Linear_Actuator_Size_NEMA_23_:_57J47-05-003ENG#2) B
- (near Haydon/Kerk#1) Belden 9504 4-pair 1 shield
- (near Haydon/Kerk#2) Belden 9504 4-pair 1 shield
- P1 FOCUS
- LIMITS
- P2 FOCUS
- (near TMG_5609L-0502_Hybrid_Stepper_Motor#1) FILTER WHEEL 1 - SIX POSITIONS
- (near TMG_5609L-0502_Hybrid_Stepper_Motor#2) FILTER WHEEL 2 - SIX POSITIONS
- (near TMG_5609L-0502_Hybrid_Stepper_Motor#1) A
- (near TMG_5609L-0502_Hybrid_Stepper_Motor#2) A
- FILTER WHEEL 1
- MOTOR D
- (near B#1) MS3106F18-1S
- (near B#1) I
- (near B#1) MS3102R18-1P
- (near TMG_5609L-0502_Hybrid_Stepper_Motor#1) B
- FILTER WHEEL 2
- (near B#2) MS3106F18-1S
- (near B#2) I
- (near B#2) MS3102R18-1P
- (near TMG_5609L-0502_Hybrid_Stepper_Motor#2) B
- 26 PIN HD-D CONNECTOR ?
- ENCODER INPUT D
- (near B#1) BELDEN 9504
- (near B#3) B
- (near B#5) A
- (near B#7) H
- MOTOR H
- (near B#4) B
- (near B#6) A
- (near Q1) 12
- (near Q1) OPWR
- ENCODER INPUT A2
- CLK+
- CLK-
- 5VDC
- 24
- (near B#9) D
- (near B#11) F
- (near BEI-HS35F_SSI_Absolute_Encoder#1) Belden 9504 4-pair 1 shield
- ENCODER INPUT H
- (near B#10) D
- (near B#12) F
- (near B#8) H
- (near BEI-HS35F_SSI_Absolute_Encoder#2) Belden 9504 4-pair 1 shield
- DO7
- DO8
- 43
- 29
- (near Q1) 1
- (near Q1) ORET
- SSI INPUT 1
- DATA+
- DATA-
- 5RET
- (near B#15) C
- (near B#13) G
- (near S7#7) Detent A  microswitch  Honeywell 311SM4-T
- (near B#16) C
- (near B#14) G
- (near S7#8) Detent A  microswitch  Honeywell 311SM4-T
- DO5
- DO6
- 28
- DETENTS
- DO2
- DO3
- DO4
- 27
- 42
- (near S8#7) Detent B  microswitch  Honeywell 311SM4-T
- (near S8#8) Detent B  microswitch  Honeywell 311SM4-T
- DO1
- 41
- LED CONTROL
- I/O A-D
- DI7
- DI8
- 34
- DI4
- DI5
- DI6
- 33
- DI2
- DI3
- 32
- S-H LENSLET 1
- CONTROL
- DI1
- F.PEREZ
- Labels drawn without touching a wire or pin: 5RET, 5VDC, A, A*, B, B*, C, CLK+, CLK-, CTS+, DATA+, DATA-, RTS+, RTS-, SHEILD, Z, Z*
- Carnegie Institution of Washington
- Pasadena, California 91101
- 813 Santa Barbara Street
- The Observatories
- PHONE (626) 577-1122               FAX (626) 795-8136
- Title:
- OCIW
- Size:
- Date:
- File:
- Scale:
- Drawn By:
- Checked By:
- A. BAGISH
- alanb
- Revision:
- Sheet          of
- (in symbol ENCODER DIF) E
- (in symbol ENCODER SSI) E

### Library data of the parts
?#1-?#16 = SOCKET-DMC
B#1-B#16 = PLUG-DMC
BEI-HS35F_SSI_Absolute_Encoder#1 BEI-HS35F_SSI_Absolute_Encoder#2 = ENCODER SSI
D?#1 D?#2 = LED1: Typical RED GaAs LED; Published: 8-Jun-2000; LatestRevisionDate: 08-Jul-2005; LatestRevisionNote: Mech Layer 1 removed.; PackageReference: LED-1; Publisher: Altium Limited; PackageDescription: LED; 2 Leads
Haydon/Kerk#1 Haydon/Kerk#2 US_Digital_E2_relative#1-US_Digital_E2_relative#4 = ENCODER DIF
Haydon/Kerk_Hybrid_Linear_Actuator_Size_NEMA_23_:_57J47-05-003ENG#1 Haydon/Kerk_Hybrid_Linear_Actuator_Size_NEMA_23_:_57J47-05-003ENG#2 P1_"X" P1_"Y" P2_"X" P2_"Y" TMG_5609L-0502_Hybrid_Stepper_Motor#1 TMG_5609L-0502_Hybrid_Stepper_Motor#2 = MOTOR STEPPER
IMB_AIR_CYLINDER#1-IMB_AIR_CYLINDER#6 = AIR CYL LONG IN
Q1 = Photo NPN: NPN Phototransistor; Published: 24-Mar-1999; LatestRevisionDate: 17-Jul-2002; LatestRevisionNote: Re-released for DXP Platform.; PackageReference: TO-220_A; Publisher: Altium Limited; Code_JEDEC: TO-220-AC
R?#1 R?#2 = Res3: Resistor; Published: 8-Jun-2000; LatestRevisionDate: 29-May-2009; LatestRevisionNote: IPC-7351 Footprint Added.; PackageReference: J1-0603; Publisher: Altium Limited; PackageDescription: Chip Resistor
S7#1-S7#8 S8#1-S8#8 = SW-SPST: Single-Pole, Single-Throw Switch; Published: 24-Mar-1999; LatestRevisionDate: 17-Jul-2002; LatestRevisionNote: Re-released for DXP Platform.; Publisher: Altium Limited

## Sheet HARNESS.SchDoc: HARNESS
size 558 x 401 mm; Organization: Carnegie Institution of Washington; DocumentNumber: 4; SheetNumber: 4; SheetTotal: 8; DrawnBy: A. BAGISH; Engineer: A. BAGISH; PageSetup: Record=PageOptions|CenterHorizontal=True|CenterVertical=True|PrintScale=1.12|XCorrection=1.00|YCorrection=1.00|PrintKind=0|BorderSize=5000000|LeftOffset=0|BottomOffset=0|Orientation=2|PaperLength=1000|PaperWidth=1000|Scale=100|PaperSource=15|PrintQuality=1200|MediaType=1|DitherType=10|PaperKind=11 x 17|PrintScaleMode=1; DocumentName: HARNESS
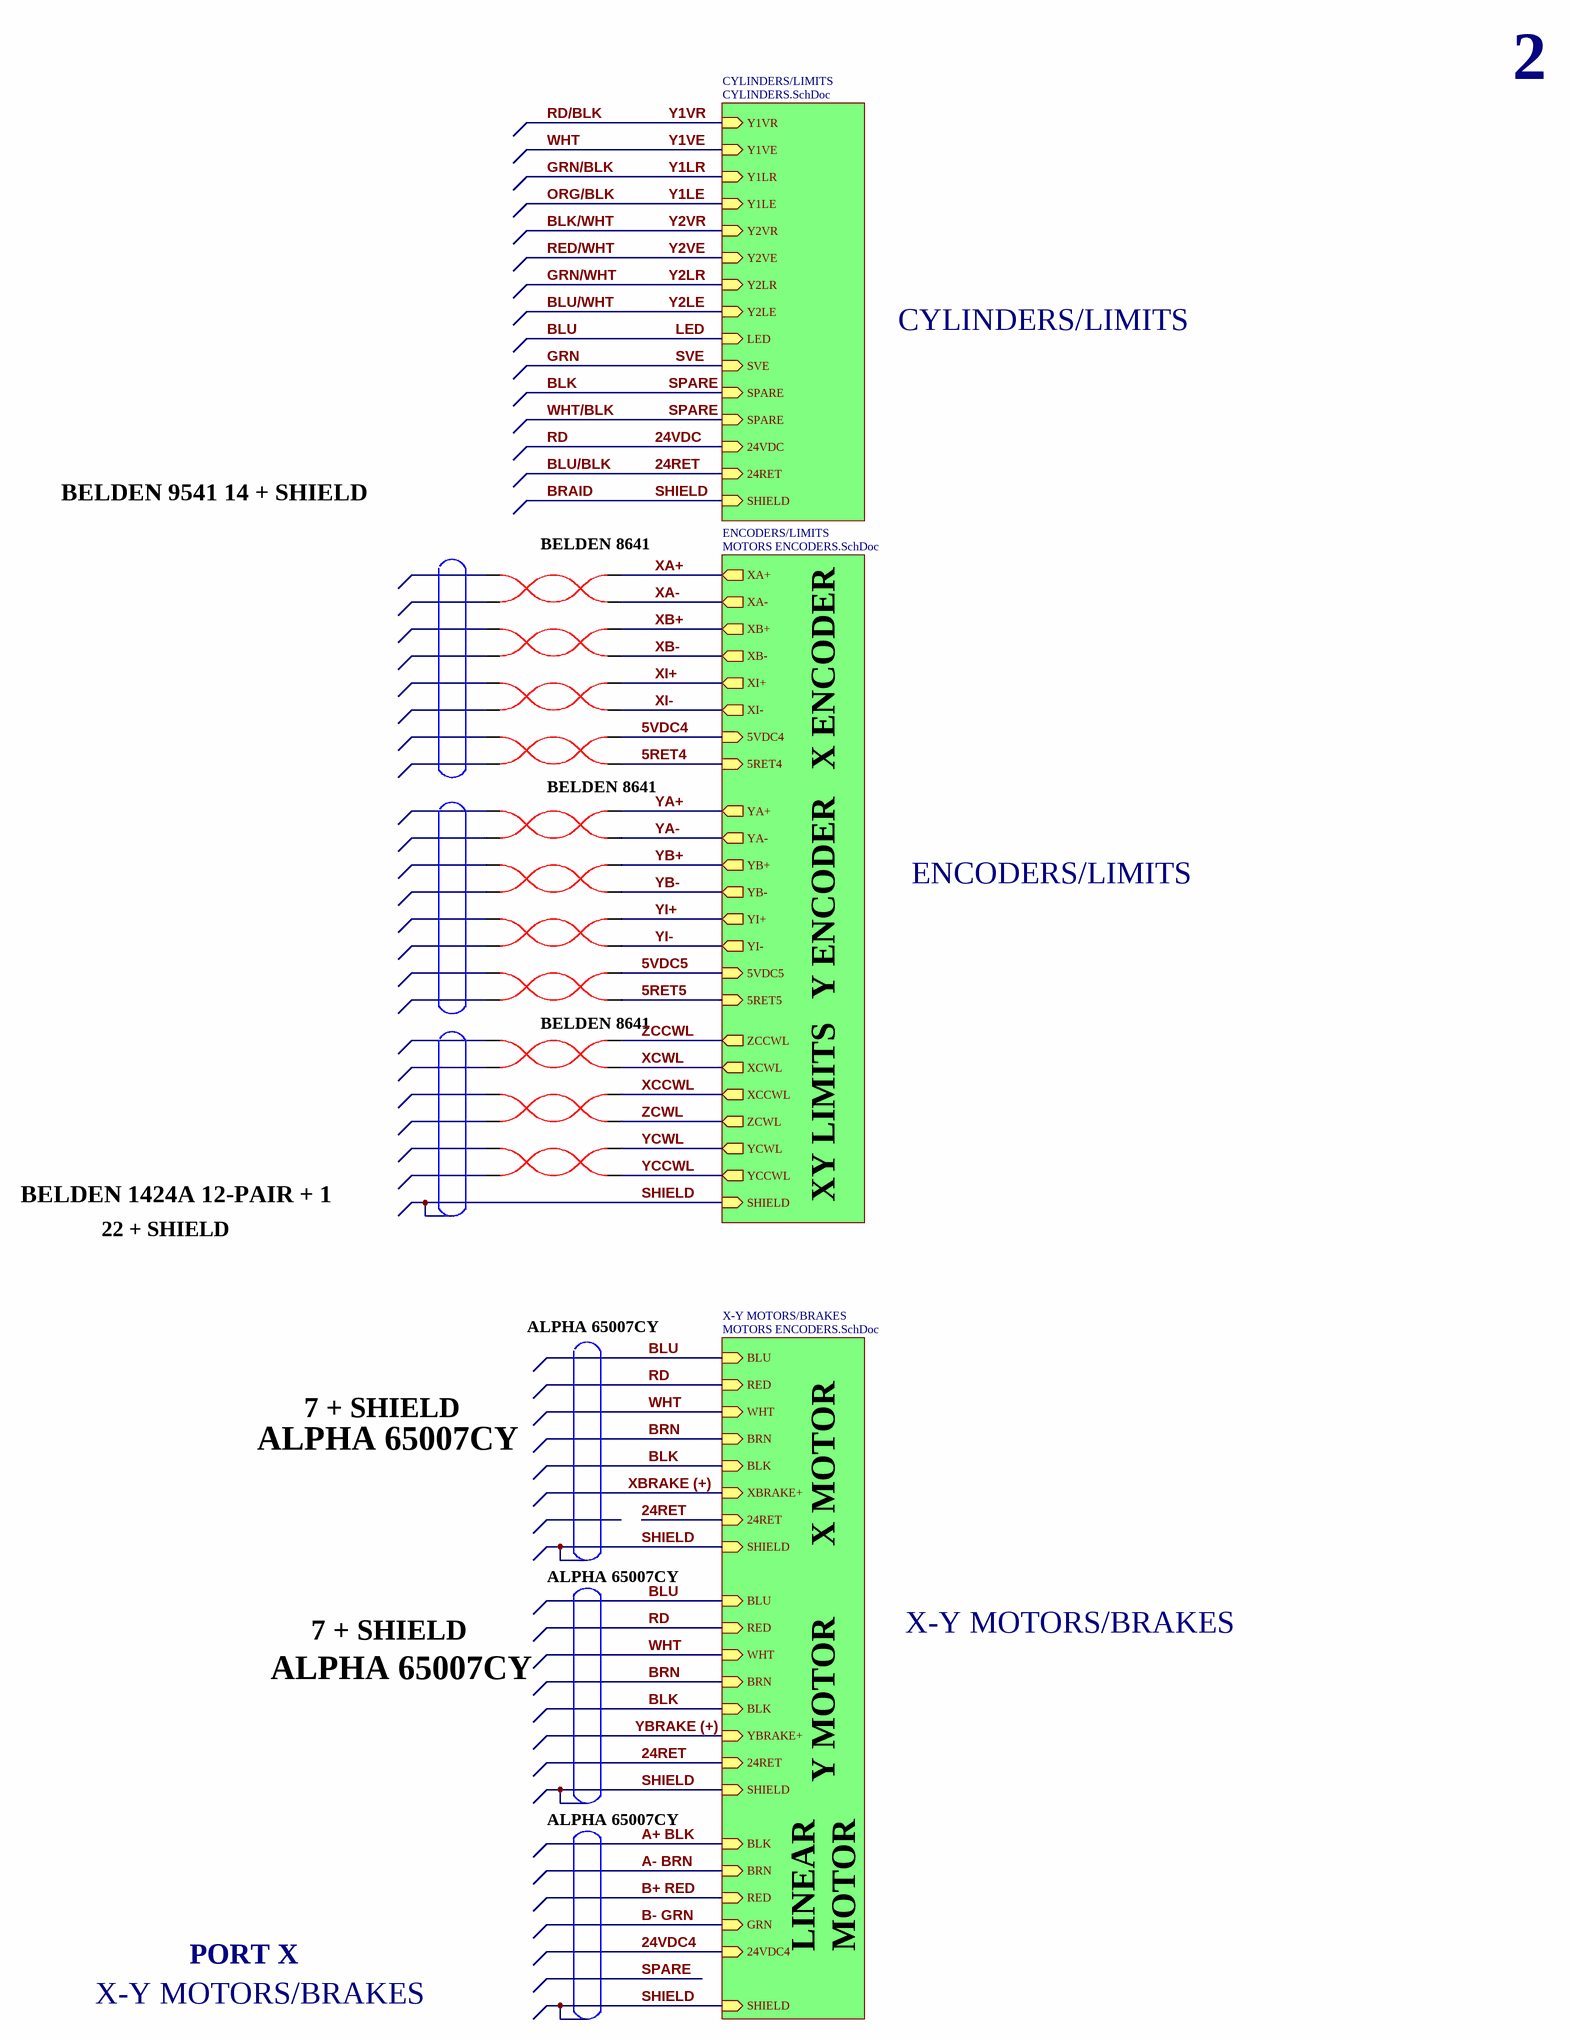
[diagram p10: HARNESS.SchDoc]

### Parts
(Parts that share a designator on the sheet are numbered #1, #2 ... from top to bottom, then left to right.)
?#17  (no value)
?#18  (no value)
?#19  (no value)
?#20  (no value)
?#21  (no value)
?#22  (no value)
?#23  (no value)
?#24  (no value)
?#25  (no value)
?#26  (no value)
?#27  (no value)

### Sub-sheets
CYLINDERS/LIMITS = CYLINDERS.SchDoc: Y1VR (in), Y1VE (in), Y1LR (in), Y1LE (in), Y2VR (in), Y2VE (in), Y2LR (in), Y2LE (in), LED (in), SVE (in), SPARE (in), SPARE (in), 24VDC (in), 24RET (in), SHIELD (in)
ENCODERS/LIMITS = MOTORS ENCODERS.SchDoc: XA+, XA-, XB+, XB-, XI+, XI-, YA+, YA-, YB+, YB-, YI+, YI-, ZCCWL, XCWL, XCCWL, ZCWL, YCWL, YCCWL, 5VDC4, 5RET4, 5VDC5, 5RET5, SHIELD
X-Y MOTORS/BRAKES = MOTORS ENCODERS.SchDoc: BLU, RED, WHT, BRN, BLK, XBRAKE+, 24RET, SHIELD, BLK, BRN, RED, GRN, SHIELD, BLU, RED, WHT, BRN, BLK, YBRAKE+, 24RET, SHIELD, 24VDC4

### Nets
5RET4: ?#20.2 ; sheet ENCODERS/LIMITS/5RET4
5RET5: ?#24.2 ; sheet ENCODERS/LIMITS/5RET5
5VDC4: ?#20.1 ; sheet ENCODERS/LIMITS/5VDC4
5VDC5: ?#24.1 ; sheet ENCODERS/LIMITS/5VDC5
24RET: sheet CYLINDERS/LIMITS/24RET, sheet X-Y MOTORS/BRAKES/24RET, sheet X-Y MOTORS/BRAKES/24RET  [also labelled BLU/BLK]
24VDC: sheet CYLINDERS/LIMITS/24VDC, sheet X-Y MOTORS/BRAKES/RED, sheet X-Y MOTORS/BRAKES/RED, sheet X-Y MOTORS/BRAKES/RED  [also labelled B+ RED, RD]
24VDC4: sheet X-Y MOTORS/BRAKES/24VDC4
A+ BLK: sheet CYLINDERS/LIMITS/SPARE, sheet CYLINDERS/LIMITS/SPARE, sheet X-Y MOTORS/BRAKES/BLK, sheet X-Y MOTORS/BRAKES/BLK, sheet X-Y MOTORS/BRAKES/BLK  [also labelled BLK, SPARE, WHT/BLK]
A- BRN: sheet X-Y MOTORS/BRAKES/BRN, sheet X-Y MOTORS/BRAKES/BRN, sheet X-Y MOTORS/BRAKES/BRN  [also labelled BRN]
B- GRN: sheet X-Y MOTORS/BRAKES/GRN
BLU: sheet CYLINDERS/LIMITS/LED, sheet X-Y MOTORS/BRAKES/BLU, sheet X-Y MOTORS/BRAKES/BLU  [also labelled LED]
BRAID: sheet CYLINDERS/LIMITS/SHIELD, sheet ENCODERS/LIMITS/SHIELD, sheet X-Y MOTORS/BRAKES/SHIELD, sheet X-Y MOTORS/BRAKES/SHIELD, sheet X-Y MOTORS/BRAKES/SHIELD  [also labelled SHIELD]
WHT: sheet CYLINDERS/LIMITS/Y1VE, sheet X-Y MOTORS/BRAKES/WHT, sheet X-Y MOTORS/BRAKES/WHT  [also labelled Y1VE]
XA+: ?#17.1 ; sheet ENCODERS/LIMITS/XA+
XA-: ?#17.2 ; sheet ENCODERS/LIMITS/XA-
XB+: ?#18.1 ; sheet ENCODERS/LIMITS/XB+
XB-: ?#18.2 ; sheet ENCODERS/LIMITS/XB-
XBRAKE (+): sheet X-Y MOTORS/BRAKES/XBRAKE+
XCCWL: ?#26.1 ; sheet ENCODERS/LIMITS/XCCWL
XCWL: ?#25.2 ; sheet ENCODERS/LIMITS/XCWL
XI+: ?#19.1 ; sheet ENCODERS/LIMITS/XI+
XI-: ?#19.2 ; sheet ENCODERS/LIMITS/XI-
YA+: ?#21.1 ; sheet ENCODERS/LIMITS/YA+
YA-: ?#21.2 ; sheet ENCODERS/LIMITS/YA-
YB+: ?#22.1 ; sheet ENCODERS/LIMITS/YB+
YB-: ?#22.2 ; sheet ENCODERS/LIMITS/YB-
YBRAKE (+): sheet X-Y MOTORS/BRAKES/YBRAKE+
YCCWL: ?#27.2 ; sheet ENCODERS/LIMITS/YCCWL
YCWL: ?#27.1 ; sheet ENCODERS/LIMITS/YCWL
YI+: ?#23.1 ; sheet ENCODERS/LIMITS/YI+
YI-: ?#23.2 ; sheet ENCODERS/LIMITS/YI-
ZCCWL: ?#25.1 ; sheet ENCODERS/LIMITS/ZCCWL
ZCWL: ?#26.2 ; sheet ENCODERS/LIMITS/ZCWL

Not connected (* = marked no-connect by the designer): ?#17 3 4; ?#18 3 4; ?#19 3 4; ?#20 3 4; ?#21 3 4; ?#22 3 4; ?#23 3 4; ?#24 3 4; ?#25 3 4; ?#26 3 4; ?#27 3 4

### Notes on the sheet
- 2
- CYLINDERS/LIMITS
- BELDEN 9541 14 + SHIELD
- BELDEN 8641
- X ENCODER
- ENCODERS/LIMITS
- Y ENCODER
- BELDEN 1424A 12-PAIR + 1
- 22 + SHIELD
- XY LIMITS
- ALPHA 65007CY
- 7 + SHIELD
- X MOTOR
- X-Y MOTORS/BRAKES
- Y MOTOR
- PORT X
- LINEAR
- MOTOR
- Carnegie Institution of Washington
- 813 Santa Barbara Street
- The Observatories
- PHONE (626) 577-1122               FAX (626) 795-8136
- Pasadena, California 91101
- Title:
- OCIW
- Size:
- Date:
- C
- Scale:
- Drawn By:
- Checked By:
- A. BAGISH
- alanb
- Revision:
- Sheet          of
- File:

### Library data of the parts
?#17-?#27 = TP2

## Sheet CYLINDERS.SchDoc: CYLINDERS
size 558 x 401 mm; Organization: Carnegie Institution of Washington; DocumentNumber: 5; SheetNumber: 5; SheetTotal: 8; PageSetup: Record=PageOptions|CenterHorizontal=True|CenterVertical=True|PrintScale=0.47|XCorrection=1.00|YCorrection=1.00|PrintKind=0|BorderSize=5000000|LeftOffset=0|BottomOffset=0|Orientation=2|PaperLength=1000|PaperWidth=1000|Scale=100|PaperSource=259|PrintQuality=600|MediaType=1|DitherType=10|PaperKind=Letter (8.5 x 11")|PrintScaleMode=1; DocumentName: CYLINDERS
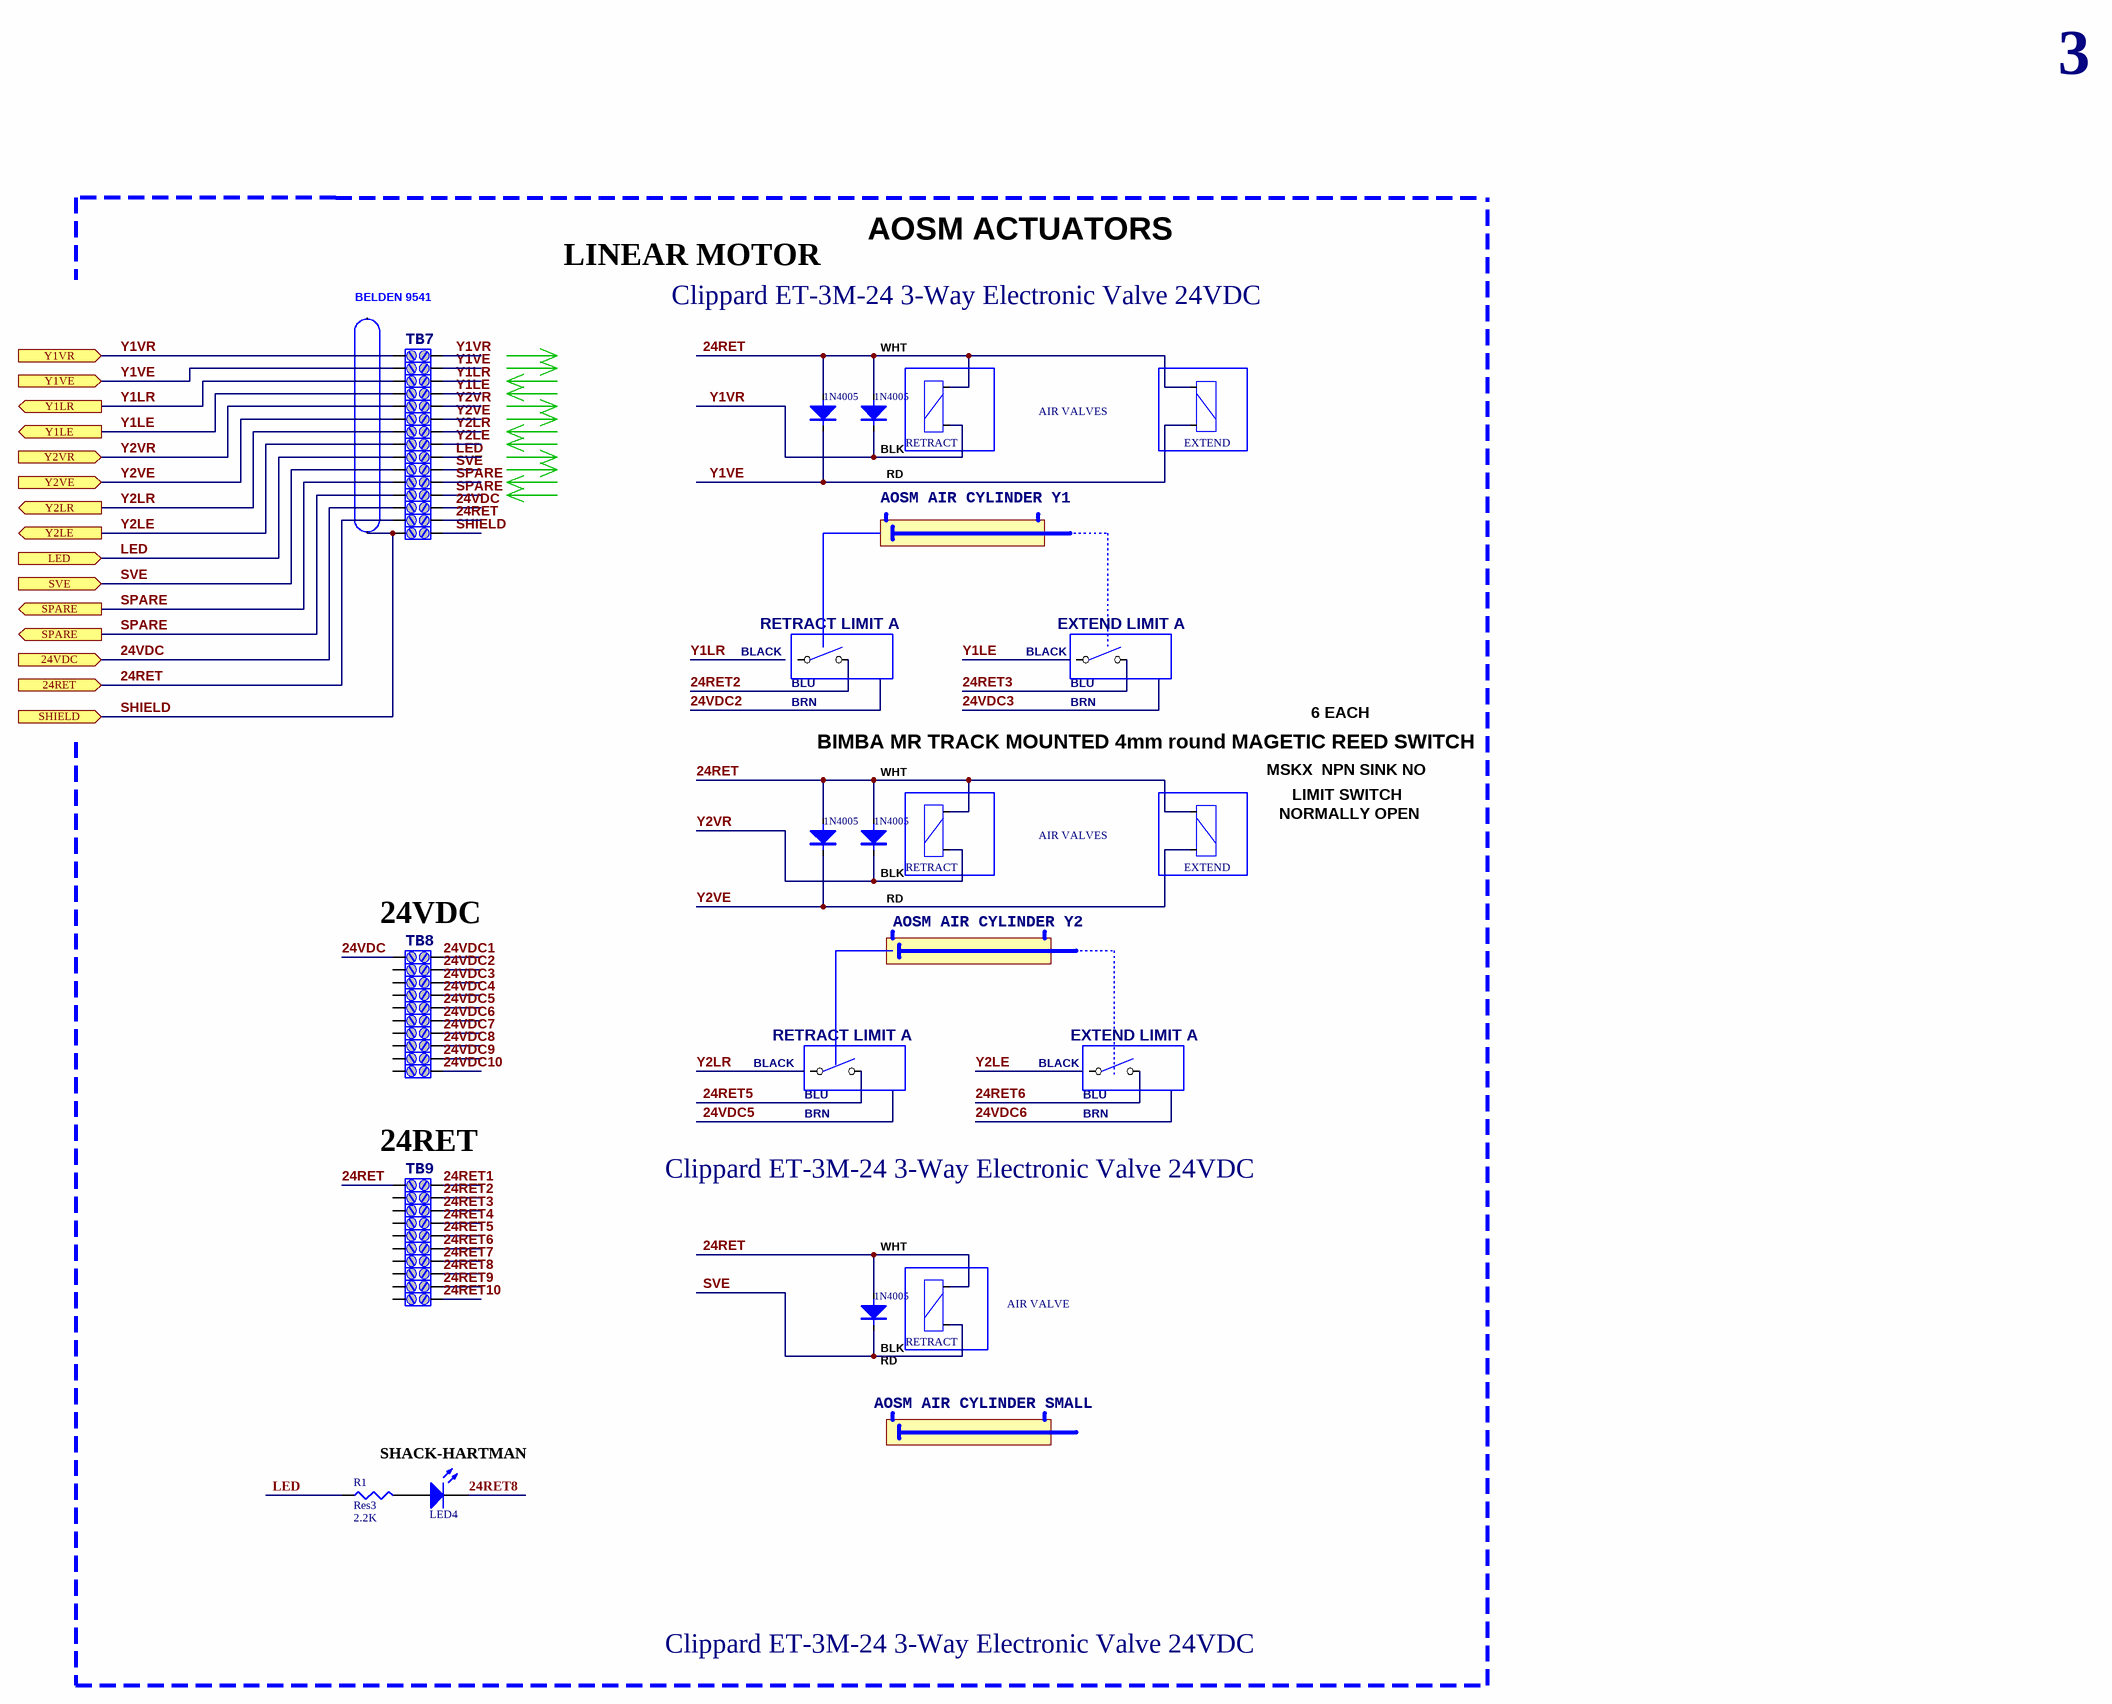
[diagram p11: CYLINDERS.SchDoc]

### Parts
(Parts that share a designator on the sheet are numbered #1, #2 ... from top to bottom, then left to right.)
?#28  (no value)
?#29  (no value)
?#30  (no value)
?#31  (no value)
?#32  RETRACT
?#33  (no value)
?#34  1N4005
?#35  1N4005
?#36  (no value)
?#37  (no value)
?#38  (no value)
?#39  (no value)
?#40  (no value)
?#41  (no value)
?#42  (no value)
?#43  (no value)
?#44  (no value)
?#45  (no value)
?#46  (no value)
?#47  (no value)
?#48  (no value)
?#49  RETRACT
?#50  1N4005
?#51  1N4005
?#52  (no value)
?#53  (no value)
?#54  (no value)
?#55  (no value)
?#56  (no value)
?#57  (no value)
?#58  (no value)
?#59  (no value)
?#60  (no value)
?#61  (no value)
?#62  (no value)
?#63  (no value)
?#64  (no value)
?#65  (no value)
?#66  (no value)
?#67  (no value)
?#68  (no value)
?#69  (no value)
?#70  (no value)
?#71  (no value)
?#72  RETRACT  S: AIR VALVE
?#73  1N4005
AIR_VALVES#1  EXTEND
AIR_VALVES#2  EXTEND
AOSM_AIR_CYLINDER_SMALL  (no value)
AOSM_AIR_CYLINDER_Y1  (no value)
AOSM_AIR_CYLINDER_Y2  (no value)
D?#3  LED4  [LED-0]
R1#1  Res3  value 2.2K  [J1-0603]
TB7#1  (no value)
TB8  (no value)
TB9  (no value)

### Ports
24RET, 24VDC, LED, SHIELD, SPARE, SVE, Y1LE, Y1LR, Y1VE, Y1VR, Y2LE, Y2LR, Y2VE, Y2VR

### Nets
24RET: ?#32.10(-) ?#34.1(A) ?#35.1(A) ?#45.1 ?#45.2 ?#49.10(-) ?#50.1(A) ?#51.1(A) ?#72.10(-) ?#73.1(A) AIR_VALVES#1.10(-) AIR_VALVES#2.10(-) TB9.2 ; port 24RET
24RET1: TB9.1
24RET2: ?#47.2 ?#63.1
24RET3: ?#48.2 ?#64.1
24RET4: ?#65.1
24RET5: ?#61.2 ?#66.1
24RET6: ?#62.2 ?#67.1
24RET7: ?#68.1
24RET8: ?#69.1 D?#3.2(K)
24RET9: ?#70.1
24RET10: ?#71.1
24VDC: ?#43.1 ?#43.2 TB8.2 ; port 24VDC
24VDC1: TB8.1
24VDC2: ?#52.1
24VDC3: ?#53.1
24VDC4: ?#54.1
24VDC5: ?#55.1
24VDC6: ?#56.1
24VDC7: ?#57.1
24VDC8: ?#58.1
24VDC9: ?#59.1
24VDC10: ?#60.1
LED: ?#39.1 ?#39.2 R1#1.1 ; port LED  [project net BLU]
SHIELD: ?#44.29(SENCE_HI) ?#46.1 ?#46.2 ; port SHIELD  [project net BRAID]
SPARE: ?#41.1 ?#41.2 ?#42.1 ?#42.2 ; port SPARE  [project net A+ BLK]
SVE: ?#40.1 ?#40.2 ?#72.2(+) ?#73.2(K) ; port SVE  [project net GRN]
Y1LE: ?#31.1 ?#31.2 ; port Y1LE  [project net ORG/BLK]
Y1LR: ?#30.1 ?#30.2 ; port Y1LR  [project net GRN/BLK]
Y1VE: ?#29.1 ?#29.2 ?#34.2(K) AIR_VALVES#1.2(+) ; port Y1VE  [project net WHT]
Y1VR: ?#32.2(+) ?#35.2(K) TB7#1.1 TB7#1.2 ; port Y1VR  [project net RD/BLK]
Y2LE: ?#38.1 ?#38.2 ; port Y2LE  [project net BLU/WHT]
Y2LR: ?#37.1 ?#37.2 ; port Y2LR  [project net GRN/WHT]
Y2VE: ?#36.1 ?#36.2 ?#50.2(K) AIR_VALVES#2.2(+) ; port Y2VE  [project net RED/WHT]
Y2VR: ?#33.1 ?#33.2 ?#49.2(+) ?#51.2(K) ; port Y2VR  [project net BLK/WHT]
NetD?#3_1: D?#3.1(A) R1#1.2

Not connected (* = marked no-connect by the designer): ?#28 29(SENCE_HI); ?#47 1; ?#48 1; ?#52 2; ?#53 2; ?#54 2; ?#55 2; ?#56 2; ?#57 2; ?#58 2; ?#59 2; ?#60 2; ?#61 1; ?#62 1; ?#63 2; ?#64 2; ?#65 2; ?#66 2; ?#67 2; ?#68 2; ?#69 2; ?#70 2; ?#71 2

### Notes on the sheet
- 3
- LINEAR MOTOR
- AOSM ACTUATORS
- BELDEN 9541
- Clippard ET-3M-24 3-Way Electronic Valve 24VDC
- WHT
- BLK
- RD
- BLACK
- RETRACT LIMIT A
- EXTEND LIMIT A
- BLU
- BRN
- 6 EACH
- BIMBA MR TRACK MOUNTED 4mm round MAGETIC REED SWITCH
- MSKX  NPN SINK NO
- NORMALLY OPEN
- LIMIT SWITCH
- (near TB8) 24VDC
- (near TB9) 24RET
- SHACK-HARTMAN
- Carnegie Institution of Washington
- 813 Santa Barbara Street
- The Observatories
- PHONE (626) 577-1122               FAX (626) 795-8136
- Pasadena, California 91101
- Title:
- OCIW
- Size:
- Date:
- C
- Scale:
- Drawn By:
- Checked By:
- A. BAGISH
- alanb
- Revision:
- Sheet          of
- File:

### Library data of the parts
?#28 ?#44 = ARC
?#29 ?#52 ?#63 = TB3: Part Field 1: 23; Part Field 2: 24
?#30 ?#53 ?#64 = TB3: Part Field 1: 25; Part Field 2: 26
?#31 ?#54 ?#65 = TB3: Part Field 1: 27; Part Field 2: 28
?#32 ?#49 ?#72 AIR_VALVES#1 AIR_VALVES#2 = COIL2
?#33 ?#55 ?#66 = TB3: Part Field 1: 29; Part Field 2: 30
?#34 ?#35 ?#50 ?#51 ?#73 = DIODE(SHORT)
?#36 ?#56 ?#67 = TB3: Part Field 1: 31; Part Field 2: 32
?#37 ?#57 ?#68 = TB3: Part Field 1: 33; Part Field 2: 34
?#38 ?#58 ?#69 = TB3: Part Field 1: 35; Part Field 2: 36
?#39 ?#59 ?#70 = TB3: Part Field 1: 37; Part Field 2: 38
?#40-?#43 ?#45 ?#46 ?#60 ?#71 = TB3: Part Field 1: 39; Part Field 2: 40
?#47 ?#48 ?#61 ?#62 = SW-SPST
AOSM_AIR_CYLINDER_SMALL AOSM_AIR_CYLINDER_Y1 AOSM_AIR_CYLINDER_Y2 = AIR CYL LONG IN
D?#3 = LED0: Typical INFRARED GaAs LED; Manuf #: 607-1212-120F; Published: 8-Jun-2000; LatestRevisionDate: 08-Jul-2005; LatestRevisionNote: Mech Layer 1 removed.; PackageReference: LED-0; Publisher: Altium Limited
R1#1 = Res3: Resistor; Published: 8-Jun-2000; LatestRevisionDate: 04-Mar-2005; LatestRevisionNote: PCB Footprint replaced.; PackageReference: J1-0603; Publisher: Altium Limited
TB7#1 TB8 TB9 = TB3: Part Field 1: 21; Part Field 2: 22

## Sheet MOTORS ENCODERS.SchDoc: MOTORS & ENCODERS
size 558 x 401 mm; Organization: Carnegie Institution of Washington; DocumentNumber: 6; SheetNumber: 5; SheetTotal: 7; PageSetup: Record=PageOptions|CenterHorizontal=True|CenterVertical=True|PrintScale=0.47|XCorrection=1.00|YCorrection=1.00|PrintKind=0|BorderSize=5000000|LeftOffset=0|BottomOffset=0|Orientation=2|PaperLength=1000|PaperWidth=1000|Scale=100|PaperSource=259|PrintQuality=600|MediaType=1|DitherType=10|PaperKind=11 x 17|PrintScaleMode=1
Used 2 times, as channels ENCODERS/LIMITS, X-Y MOTORS/BRAKES. Parts and nets are listed once, with the designators drawn on the sheet.
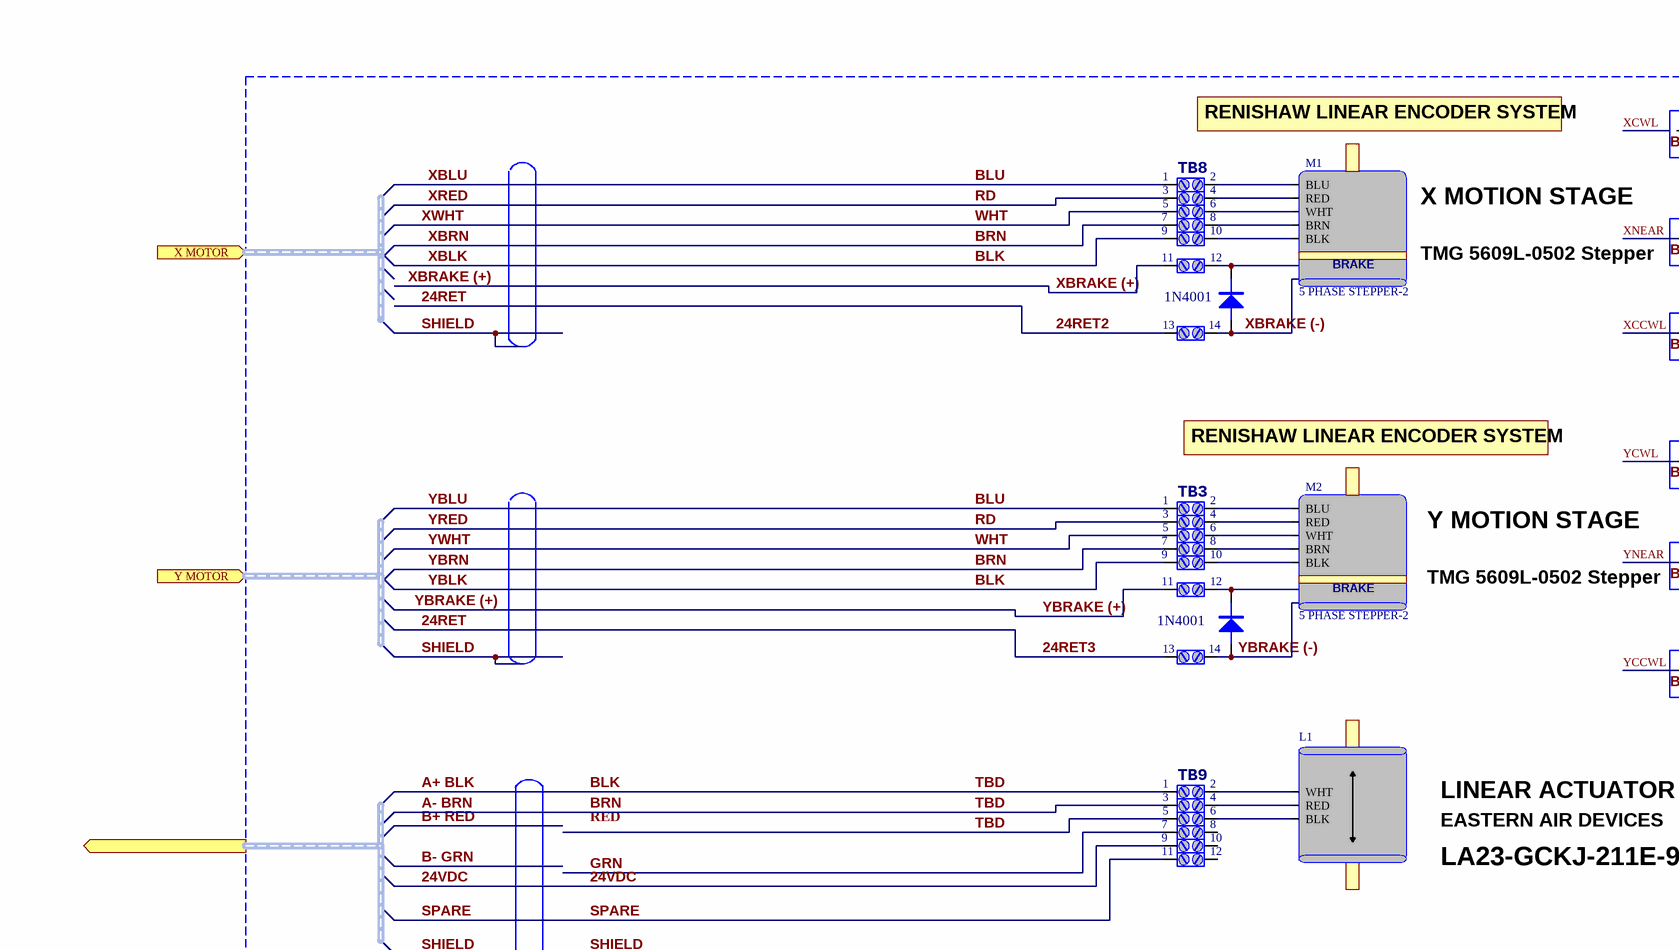
[diagram p12: MOTORS ENCODERS.SchDoc, top left]
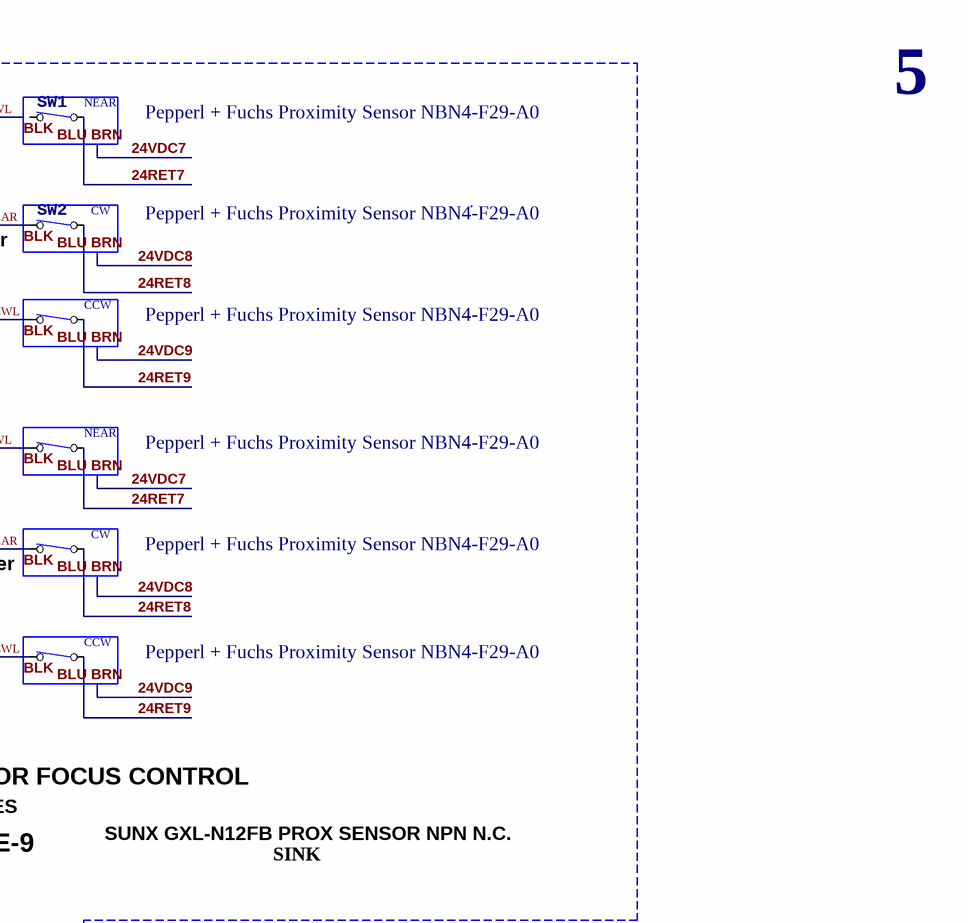
[diagram p13: MOTORS ENCODERS.SchDoc, top right]
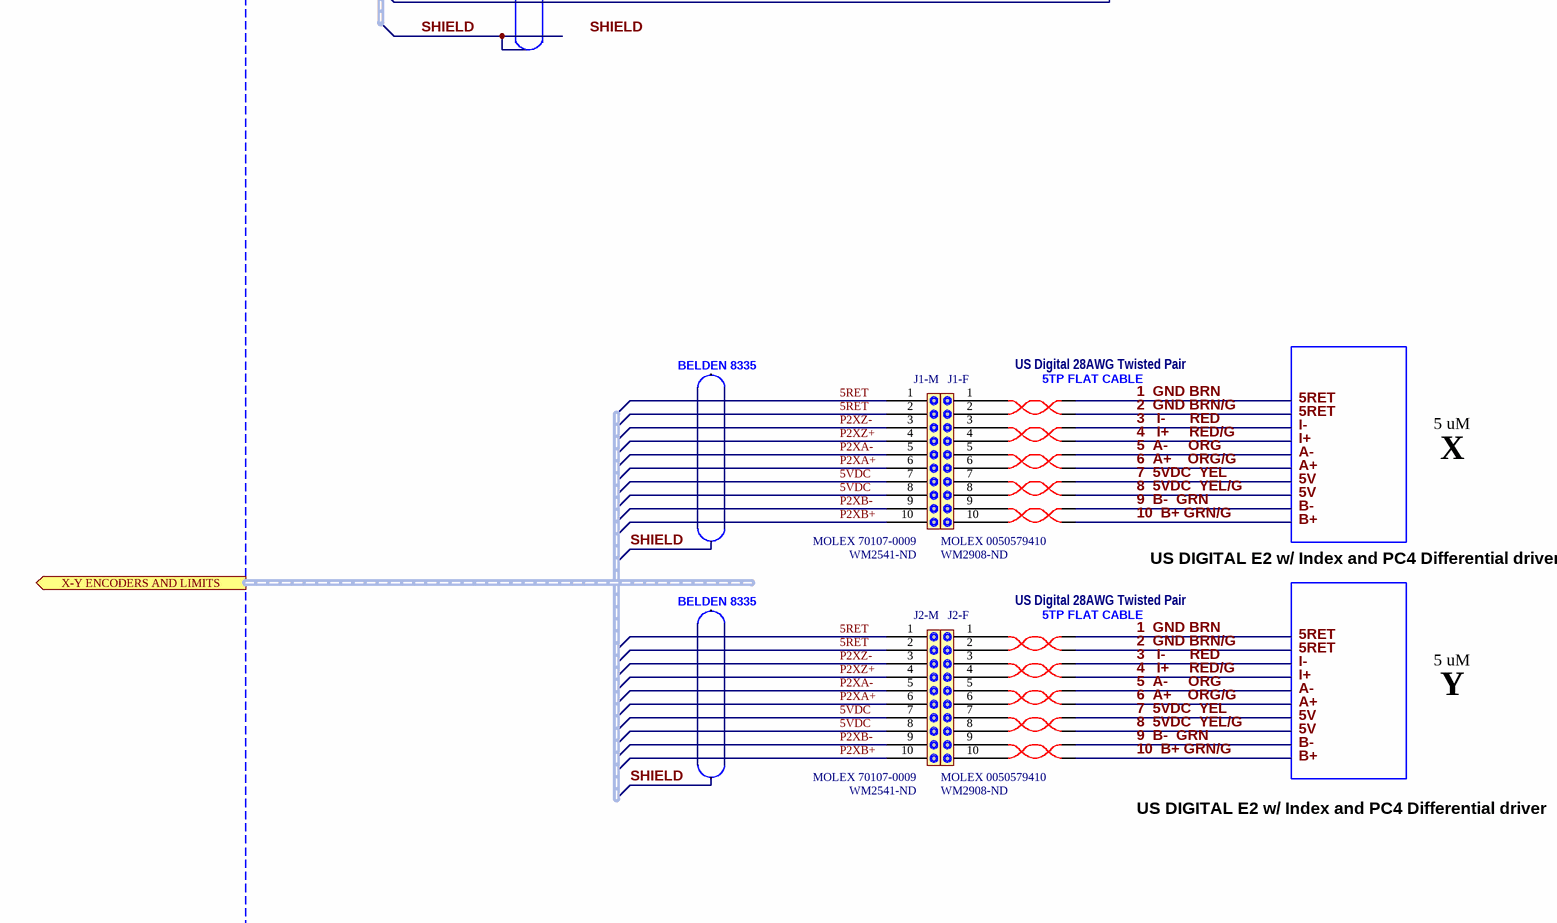
[diagram p14: MOTORS ENCODERS.SchDoc, bottom left]

### Parts
(Parts that share a designator on the sheet are numbered #1, #2 ... from top to bottom, then left to right.)
?#1  Part Field 1: 3  Part Field 2: 4
?#2  Part Field 1: 5  Part Field 2: 6
?#3  Part Field 1: 7  Part Field 2: 8
?#4  Part Field 1: 9  Part Field 2: 10
?#5  Part Field 1: 11  Part Field 2: 12
?#6  (no value)
?#7  Part Field 1: 13  Part Field 2: 14
?#8  (no value)
?#9  (no value)
?#10  Part Field 1: 3  Part Field 2: 4
?#11  Part Field 1: 5  Part Field 2: 6
?#12  Part Field 1: 7  Part Field 2: 8
?#13  Part Field 1: 9  Part Field 2: 10
?#14  (no value)
?#15  Part Field 1: 11  Part Field 2: 12
?#16  (no value)
?#17  Part Field 1: 13  Part Field 2: 14
?#18  (no value)
?#19  Part Field 1: 3  Part Field 2: 4
?#20  Part Field 1: 5  Part Field 2: 6
?#21  Part Field 1: 7  Part Field 2: 8
?#22  Part Field 1: 9  Part Field 2: 10
?#23  Part Field 1: 11  Part Field 2: 12
?#24  (no value)
?#25  TP1  (value not drawn)
?#26  TP1  (value not drawn)
?#27  TP1  (value not drawn)
?#28  TP1  (value not drawn)
?#29  TP1  (value not drawn)
?#30  (no value)
?#31  (no value)
?#32  TP1  (value not drawn)
?#33  TP1  (value not drawn)
?#34  TP1  (value not drawn)
?#35  TP1  (value not drawn)
?#36  TP1  (value not drawn)
?#37  (no value)
J1-F  MOLEX 0050579410  Digikey: WM2908-ND
J1-M  MOLEX 70107-0009  Digikey: WM2541-ND
J2-F  MOLEX 0050579410  Digikey: WM2908-ND
J2-M  MOLEX 70107-0009  Digikey: WM2541-ND
L1  LINEAR MOTOR  (value not drawn)
M1  5 PHASE STEPPER-2
M2  5 PHASE STEPPER-2
SW1  (no value)
SW2  (no value)
TB3  Part Field 1: 1  Part Field 2: 2
TB8  Part Field 1: 1  Part Field 2: 2
TB9  Part Field 1: 1  Part Field 2: 2

### Blocks framed on the sheet
NEAR: SW1
CW: SW2
CCW: ?#8
NEAR: ?#9
CW: ?#14
CCW: ?#18

### Ports
X MOTOR, X-Y ENCODERS AND LIMITS, Y MOTOR, 

### Nets
1  GND BRN: ?#25.18 ?#32.18
2  GND BRN/G: ?#25.17 ?#32.17
3   I-      RED: ?#26.18 ?#33.18
4   I+     RED/G: ?#26.17 ?#33.17
5  A-     ORG: ?#27.18 ?#34.18
5RET: J1-M.1 J1-M.2 J2-M.1 J2-M.2
5VDC: J1-M.7 J1-M.8 J2-M.7 J2-M.8
6  A+    ORG/G: ?#27.17 ?#34.17
7  5VDC  YEL : ?#28.18 ?#35.18
8  5VDC  YEL/G : ?#28.17 ?#35.17
9  B-  GRN: ?#29.18 ?#36.18
10  B+ GRN/G: ?#29.17 ?#36.17
24RET: ?#7.2 ?#17.2  [also labelled 24RET2, 24RET3]
24RET7: ?#9.1 SW1.1
24RET8: ?#14.1 SW2.1
24RET9: ?#8.1 ?#18.1
24VDC: ?#22.2
A+ BLK: ?#3.2 ?#4.2 ?#12.2 ?#13.2 ?#19.2 ?#20.2 TB9.2  [also labelled A- BRN, BLK, BRN, TBD, XBLK, XBRN, YBLK, YBRN]
BLU: TB3.2 TB8.2  [also labelled XBLU, YBLU]
GRN: ?#21.2
P2XA+: J1-M.6 J2-M.6
P2XA-: J1-M.5 J2-M.5
P2XB+: J1-M.10 J2-M.10
P2XB-: J1-M.9 J2-M.9
P2XZ+: J1-M.4 J2-M.4
P2XZ-: J1-M.3 J2-M.3
RD: ?#1.2 ?#10.2  [also labelled XRED, YRED]
SHIELD: ?#30.29(SENCE_HI) ?#37.29(SENCE_HI)
SPARE: ?#23.2
WHT: ?#2.2 ?#11.2  [also labelled XWHT, YWHT]
XBRAKE (+): ?#5.2
XBRAKE (-): ?#6.A ?#7.1
XCCWL: ?#8.2
XNEAR: SW2.2
YBRAKE (+): ?#15.2
YBRAKE (-): ?#16.A ?#17.1
YCCWL: ?#18.2
YCWL: ?#9.2
YNEAR: ?#14.2
Net?#1_1: ?#1.1 M1.?2(RED)
Net?#2_1: ?#2.1 M1.?3(WHT)
Net?#3_1: ?#3.1 M1.?4(BRN)
Net?#4_1: ?#4.1 M1.?5(BLK)
Net?#5_1: ?#5.1 ?#6.K
Net?#10_1: ?#10.1 M2.?2(RED)
Net?#11_1: ?#11.1 M2.?3(WHT)
Net?#12_1: ?#12.1 M2.?4(BRN)
Net?#13_1: ?#13.1 M2.?5(BLK)
Net?#15_1: ?#15.1 ?#16.K
Net?#19_1: ?#19.1 L1.?1(RED)
Net?#20_1: ?#20.1 L1.?3(BLK)
Net?#25_15: ?#25.15 J1-F.1
Net?#25_16: ?#25.16 J1-F.2
Net?#26_15: ?#26.15 J1-F.3
Net?#26_16: ?#26.16 J1-F.4
Net?#27_15: ?#27.15 J1-F.5
Net?#27_16: ?#27.16 J1-F.6
Net?#28_15: ?#28.15 J1-F.7
Net?#28_16: ?#28.16 J1-F.8
Net?#29_15: ?#29.15 J1-F.9
Net?#29_16: ?#29.16 J1-F.10
Net?#32_15: ?#32.15 J2-F.1
Net?#32_16: ?#32.16 J2-F.2
Net?#33_15: ?#33.15 J2-F.3
Net?#33_16: ?#33.16 J2-F.4
Net?#34_15: ?#34.15 J2-F.5
Net?#34_16: ?#34.16 J2-F.6
Net?#35_15: ?#35.15 J2-F.7
Net?#35_16: ?#35.16 J2-F.8
Net?#36_15: ?#36.15 J2-F.9
Net?#36_16: ?#36.16 J2-F.10
NetL1_?2: L1.?2(WHT) TB9.1
NetM1_?1: M1.?1(BLU) TB8.1
NetM2_?1: M2.?1(BLU) TB3.1

Not connected (* = marked no-connect by the designer): ?#21 1; ?#22 1; ?#23 1; ?#24 29(SENCE_HI); ?#31 29(SENCE_HI); SW1 2

### Channels
ENCODERS/LIMITS: designators end in _ENCODERS/LIMITS
X-Y MOTORS/BRAKES: designators end in _X-Y_MOTORS/BRAKES

### Notes on the sheet
- RENISHAW LINEAR ENCODER SYSTEM
- Pepperl + Fuchs Proximity Sensor NBN4-F29-A0
- 5
- (near M1) BRAKE
- TMG 5609L-0502 Stepper
- X MOTION STAGE
- 1N4001
- Y MOTION STAGE
- (near M2) BRAKE
- LINEAR ACTUATOR FOCUS CONTROL
- LA23-GCKJ-211E-9
- EASTERN AIR DEVICES
- SUNX GXL-N12FB PROX SENSOR NPN N.C.
- SINK
- BELDEN 8335
- US Digital 28AWG Twisted Pair
- 5TP FLAT CABLE
- 5 uM
- X
- US DIGITAL E2 w/ Index and PC4 Differential driver
- Y
- Labels drawn without touching a wire or pin: 5RET, 5V, A+, A-, B+, B-, BLK, BLU, BRN, I+, I-, RED, SHIELD
- Carnegie Institution of Washington
- 813 Santa Barbara Street
- The Observatories
- PHONE (626) 577-1122               FAX (626) 795-8136
- Pasadena, California 91101
- Title:
- OCIW
- Size:
- Date:
- C
- Scale:
- Drawn By:
- Checked By:
- A. BAGISH
- alanb
- Revision:
- Sheet          of
- File:

### Library data of the parts
?#1-?#5 ?#7 ?#10-?#13 ?#15 ?#17 ?#19-?#23 TB3 TB8 TB9 = TB3
?#6 ?#16 = DIODE
?#8 ?#9 ?#14 ?#18 SW1 SW2 = SW-NC2
?#24 ?#30 ?#31 ?#37 = ARC
J1-F J1-M J2-F J2-M = TP10

## Sheet POWER SUPPLY.SchDoc: POWER SUPPLY
size B; Organization: Carnegie Institution of Washington; DocumentNumber: 8; SheetNumber: 8; SheetTotal: 8; PageSetup: Record=PageOptions|CenterHorizontal=True|CenterVertical=True|PrintScale=1.12|XCorrection=1.00|YCorrection=1.00|PrintKind=0|BorderSize=5000000|LeftOffset=0|BottomOffset=0|Orientation=2|PaperLength=1000|PaperWidth=1000|Scale=100|PaperSource=15|PrintQuality=1200|MediaType=1|DitherType=10|PaperKind=11 x 17|PrintScaleMode=1
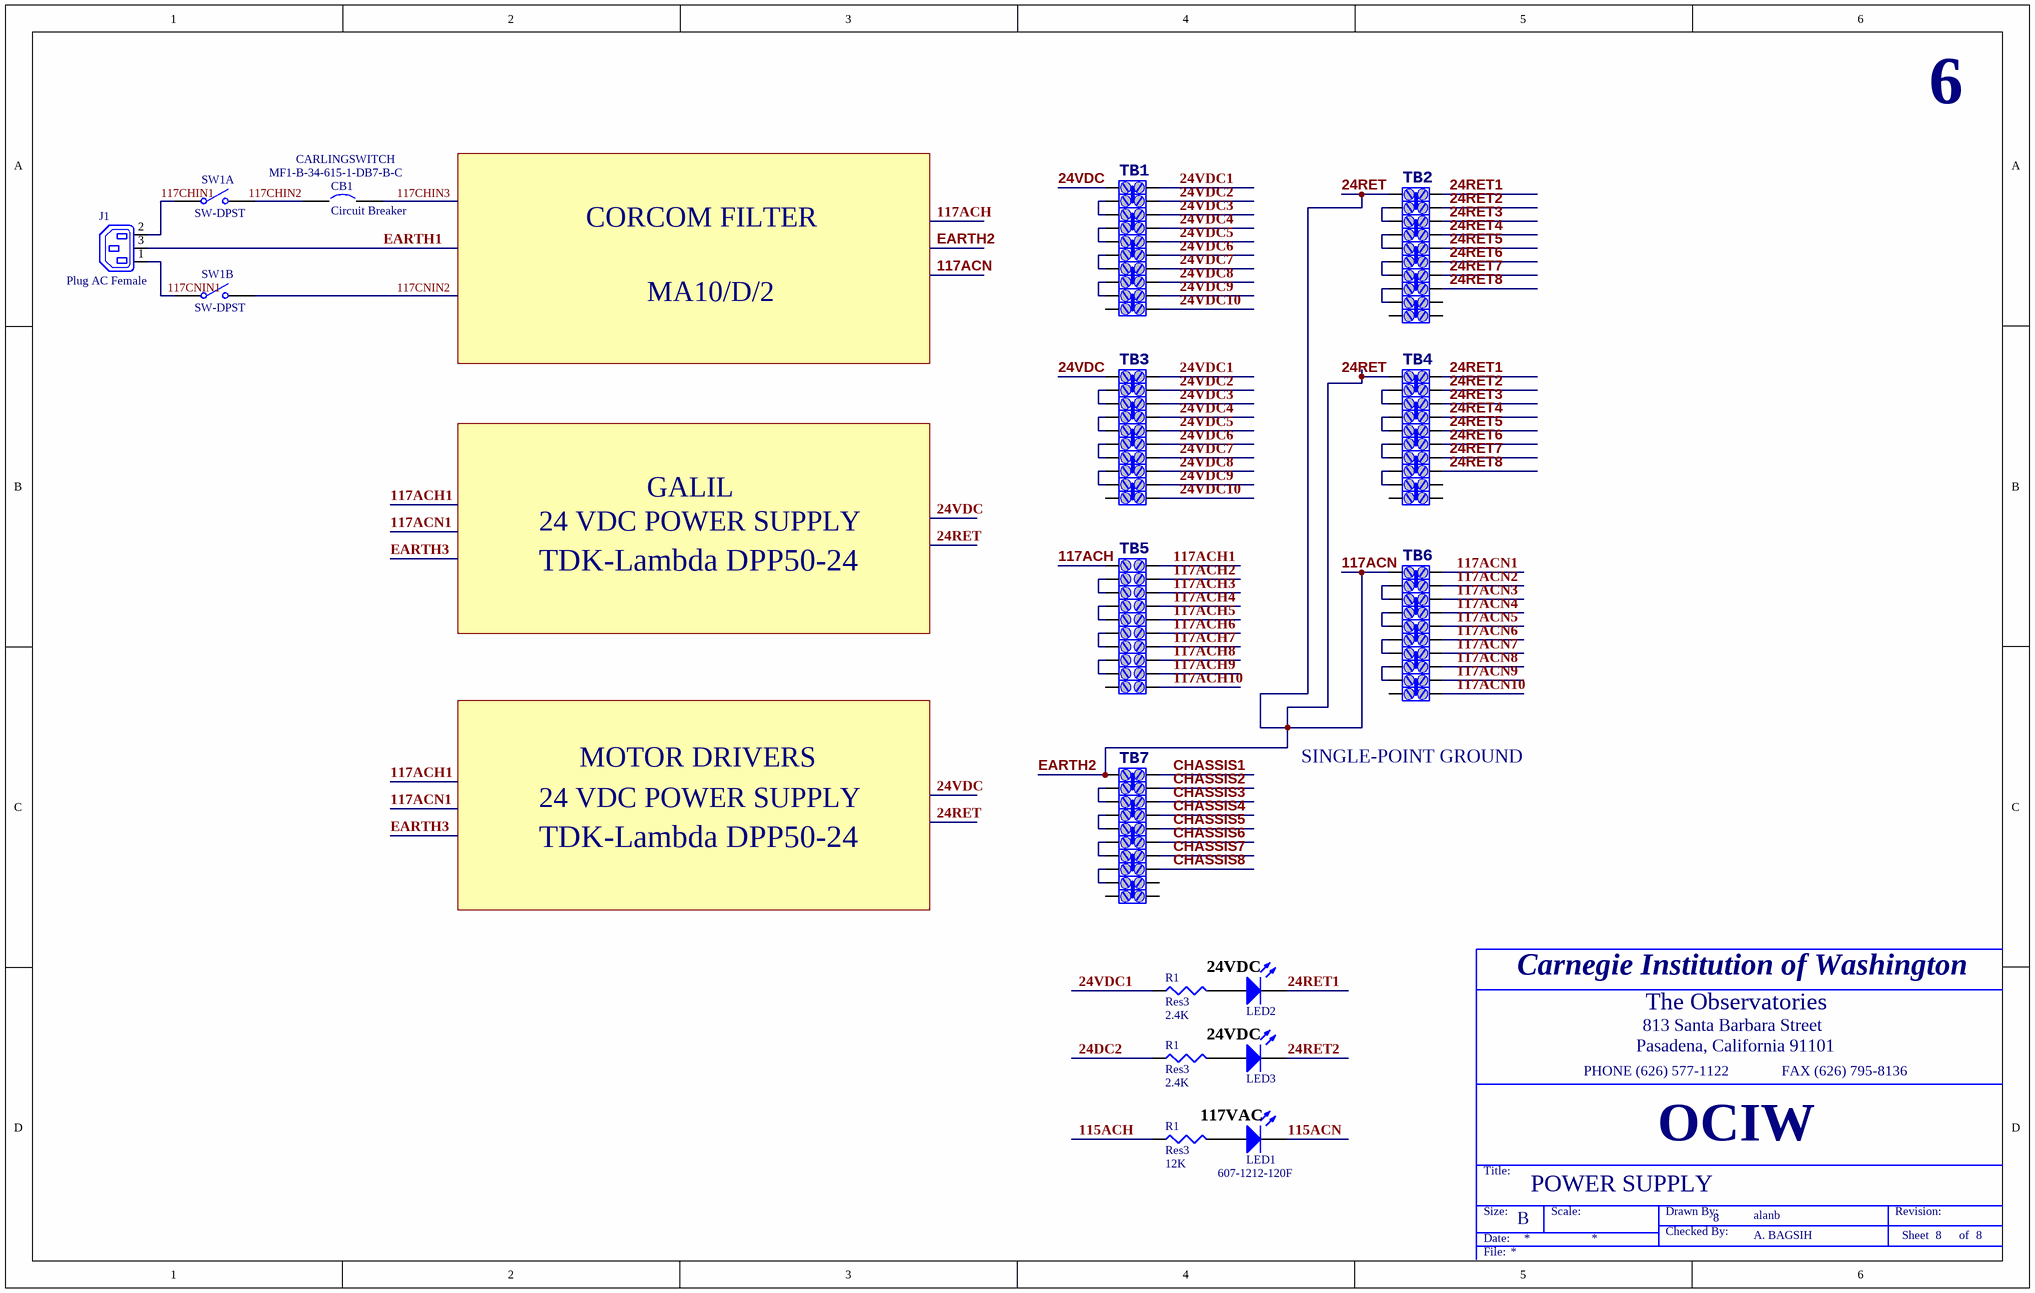
[diagram p15: POWER SUPPLY.SchDoc]

### Parts
(Parts that share a designator on the sheet are numbered #1, #2 ... from top to bottom, then left to right.)
?#74  (no value)
?#75  (no value)
?#76  (no value)
?#77  (no value)
?#78  (no value)
?#79  (no value)
?#80  (no value)
?#81  (no value)
?#82  (no value)
?#83  (no value)
?#84  (no value)
?#85  (no value)
?#86  (no value)
?#87  (no value)
?#88  (no value)
?#89  (no value)
?#90  (no value)
?#91  (no value)
?#92  (no value)
?#93  (no value)
?#94  (no value)
?#95  (no value)
?#96  (no value)
?#97  (no value)
?#98  (no value)
?#99  (no value)
?#100  (no value)
?#101  (no value)
?#102  (no value)
?#103  (no value)
?#104  (no value)
?#105  (no value)
?#106  (no value)
?#107  (no value)
?#108  (no value)
?#109  (no value)
?#110  (no value)
?#111  (no value)
?#112  (no value)
?#113  (no value)
?#114  (no value)
?#115  (no value)
?#116  (no value)
?#117  (no value)
?#118  (no value)
?#119  (no value)
?#120  (no value)
?#121  (no value)
?#122  (no value)
?#123  (no value)
?#124  (no value)
?#125  (no value)
?#126  (no value)
?#127  (no value)
?#128  (no value)
?#129  (no value)
?#130  (no value)
?#131  (no value)
?#132  (no value)
?#133  (no value)
?#134  (no value)
?#135  (no value)
?#136  (no value)
CB1  Circuit Breaker  Manufacturer: CARLINGSWITCH  PART#: MF1-B-34-615-1-DB7-B-C  [SPST-2]
D?#4  LED2  [LED-0]
D?#5  LED3  [LED-0]
D?#6  LED1  Manuf #: 607-1212-120F  [LED-0]
J1  Plug AC Female  [IEC7-2H3]
R1#2  Res3  value 2.4K  [J1-0603]
R1#3  Res3  value 2.4K  [J1-0603]
R1#4  Res3  value 12K  [J1-0603]
SW1A  SW-DPST  [SPST-2]
SW1B  SW-DPST  [SPST-2]
TB1  (no value)
TB2  (no value)
TB3  (no value)
TB4  (no value)
TB5  (no value)
TB6  (no value)
TB7#2  (no value)

### Nets
24DC2: R1#3.1
24RET1: D?#4.2(K) TB2.1 TB4.1
24RET2: ?#75.1 ?#93.1 D?#5.2(K)
24RET3: ?#77.1 ?#95.1
24RET4: ?#79.1 ?#97.1
24RET5: ?#81.1 ?#99.1
24RET6: ?#83.1 ?#101.1
24RET7: ?#85.1 ?#103.1
24RET8: ?#87.1 ?#105.1
24VDC: TB1.2 TB3.2
24VDC1: R1#2.1 TB1.1 TB3.1
24VDC2: ?#74.1 ?#92.1
24VDC3: ?#76.1 ?#94.1
24VDC4: ?#78.1 ?#96.1
24VDC5: ?#80.1 ?#98.1
24VDC6: ?#82.1 ?#100.1
24VDC7: ?#84.1 ?#102.1
24VDC8: ?#86.1 ?#104.1
24VDC9: ?#88.1 ?#106.1
24VDC10: ?#90.1 ?#108.1
115ACH: R1#4.1
115ACN: D?#6.2(K)
117ACH: TB5.2
117ACH1: TB5.1
117ACH2: ?#110.1
117ACH3: ?#112.1
117ACH4: ?#114.1
117ACH5: ?#116.1
117ACH6: ?#118.1
117ACH7: ?#120.1
117ACH8: ?#122.1
117ACH9: ?#124.1
117ACH10: ?#126.1
117ACN: TB2.2 TB4.2 TB6.2 TB7#2.2  [also labelled 24RET, EARTH2]
117ACN1: TB6.1
117ACN2: ?#111.1
117ACN3: ?#113.1
117ACN4: ?#115.1
117ACN5: ?#117.1
117ACN6: ?#119.1
117ACN7: ?#121.1
117ACN8: ?#123.1
117ACN9: ?#125.1
117ACN10: ?#127.1
117CHIN1: J1.2(N) SW1A.1(COMMON)
117CHIN3: CB1.2
117CNIN1: J1.1(L) SW1B.1(COMMON)
117CNIN2: SW1B.2(NO)
CHASSIS1: TB7#2.1
CHASSIS2: ?#128.1
CHASSIS3: ?#129.1
CHASSIS4: ?#130.1
CHASSIS5: ?#131.1
CHASSIS6: ?#132.1
CHASSIS7: ?#133.1
CHASSIS8: ?#134.1
EARTH1: J1.3(E)
NetCB1_1: CB1.1 SW1A.2(NO)
NetD?#4_1: D?#4.1(A) R1#2.2
NetD?#5_1: D?#5.1(A) R1#3.2
NetD?#6_1: D?#6.1(A) R1#4.2

Not connected (* = marked no-connect by the designer): ?#74 2; ?#75 2; ?#76 2; ?#77 2; ?#78 2; ?#79 2; ?#80 2; ?#81 2; ?#82 2; ?#83 2; ?#84 2; ?#85 2; ?#86 2; ?#87 2; ?#88 2; ?#89 1 2; ?#90 2; ?#91 1 2; ?#92 2; ?#93 2; ?#94 2; ?#95 2; ?#96 2; ?#97 2; ?#98 2; ?#99 2; ?#100 2; ?#101 2; ?#102 2; ?#103 2; ?#104 2; ?#105 2; ?#106 2; ?#107 1 2; ?#108 2; ?#109 1 2; ?#110 2; ?#111 2; ?#112 2; ?#113 2; ?#114 2; ?#115 2; ?#116 2; ?#117 2; ?#118 2; ?#119 2; ?#120 2; ?#121 2; ?#122 2; ?#123 2; ?#124 2; ?#125 2; ?#126 2; ?#127 2; ?#128 2; ?#129 2; ?#130 2; ?#131 2; ?#132 2; ?#133 2; ?#134 2; ?#135 1 2; ?#136 1 2

### Notes on the sheet
- 6
- CORCOM FILTER
- MA10/D/2
- GALIL
- 24 VDC POWER SUPPLY
- TDK-Lambda DPP50-24
- MOTOR DRIVERS
- SINGLE-POINT GROUND
- 24VDC
- 117VAC
- Labels drawn without touching a wire or pin: 24RET, 117CHIN2
- Carnegie Institution of Washington
- 813 Santa Barbara Street
- The Observatories
- PHONE (626) 577-1122               FAX (626) 795-8136
- Pasadena, California 91101
- Title:
- OCIW
- Size:
- Date:
- B
- Scale:
- Drawn By:
- Checked By:
- A. BAGSIH
- alanb
- Revision:
- Sheet          of
- File:

### Library data of the parts
?#74 ?#75 ?#92 ?#93 ?#111 ?#128 = TB3: Part Field 1: 23; Part Field 2: 24
?#76 ?#77 ?#94 ?#95 ?#113 ?#129 = TB3: Part Field 1: 25; Part Field 2: 26
?#78 ?#79 ?#96 ?#97 ?#115 ?#130 = TB3: Part Field 1: 27; Part Field 2: 28
?#80 ?#81 ?#98 ?#99 ?#117 ?#131 TB5 = TB3: Part Field 1: 29; Part Field 2: 30
?#82 ?#83 ?#100 ?#101 ?#110 ?#119 ?#132 = TB3: Part Field 1: 31; Part Field 2: 32
?#84 ?#85 ?#102 ?#103 ?#112 ?#121 ?#133 = TB3: Part Field 1: 33; Part Field 2: 34
?#86 ?#87 ?#104 ?#105 ?#114 ?#123 ?#134 = TB3: Part Field 1: 35; Part Field 2: 36
?#88 ?#89 ?#106 ?#107 ?#116 ?#125 ?#135 = TB3: Part Field 1: 37; Part Field 2: 38
?#90 ?#91 ?#108 ?#109 ?#118 ?#127 ?#136 = TB3: Part Field 1: 39; Part Field 2: 40
?#120 = TB3: Part Field 1: 41; Part Field 2: 42
?#122 = TB3: Part Field 1: 43; Part Field 2: 44
?#124 = TB3: Part Field 1: 45; Part Field 2: 46
?#126 = TB3: Part Field 1: 47; Part Field 2: 48
D?#4 D?#5 = LED0: as D?#3 on sheet CYLINDERS; Published: 8-Jun-2000; LatestRevisionDate: 08-Jul-2005; LatestRevisionNote: Mech Layer 1 removed.; PackageReference: LED-0; Publisher: Altium Limited
D?#6 = LED0: Typical INFRARED GaAs LED; Published: 8-Jun-2000; LatestRevisionDate: 08-Jul-2005; LatestRevisionNote: Mech Layer 1 removed.; PackageReference: LED-0; Publisher: Altium Limited
J1 = Plug AC Female: IEC Mains Power Outlet, EN60 320-2-2 F Class I, PC Flange Rear Mount, Chassis Socket; PackageDocument: ver.80, 15-Sep-2003; MaximumRating: 10A, 250V a.c. (UL & CSA 15A, 250V a.c.); MountingFixtures: Not drawn on schematic symbol.; PCB_Layout: Complies with manufacturer's recommendation.; DrillSize: Corresponds to nominal value.; Published: 15-Jul-2004; LatestRevisionDate: 15-Jul-2004; LatestRevisionNote: Component Replaced & renamed from "Phonejack".; DatasheetDocument: ver.80, 15-Sep-2003; PackageReference: PX0675/PC; Publisher: Altium Limited; Terminations: P.C. Spills; ComponentLink1Description: Manufacturer Link; ComponentLink1URL: http://www.bulgin.co.uk/
R1#2-R1#4 = Res3: Resistor; Published: 8-Jun-2000; LatestRevisionDate: 04-Mar-2005; LatestRevisionNote: PCB Footprint replaced.; PackageReference: J1-0603; Publisher: Altium Limited
SW1A SW1B = SW-SPST: Single-Pole, Single-Throw Switch; Published: 24-Mar-1999; LatestRevisionDate: 17-Jul-2002; LatestRevisionNote: Re-released for DXP Platform.; PackageReference: SPST-2; Publisher: Altium Limited
TB1-TB4 TB6 TB7#2 = TB3: Part Field 1: 21; Part Field 2: 22
CB1 = Circuit Breaker: Published: 24-Mar-1999; LatestRevisionDate: 17-Jul-2002; LatestRevisionNote: Re-released for DXP Platform.; PackageReference: SPST-2; Publisher: Altium Limited